# Altium schematic sheet Driver_BLDC.SchDoc
size 1600 x 1200 mm; SheetNumber: 1; SheetTotal: 1; SPICEModelCacheBTRAQOWF: <root> / <DocumentId>BTRAQOWF</DocumentId> / <CacheFrame Number="0"> / <Model Name="7850_74477530_1m" Kind="CKT"> / <Text>******* / .subckt 7850_74477530_1m 1 2 / Rp 1 2 187304.915771 / Cp 1 2 4.36976277949p / Rs 1 N3 3.3 / L1 N3 2 1000u / .ends 7850_74477530_1m</Text> / </Model> / </CacheFrame> / </root>
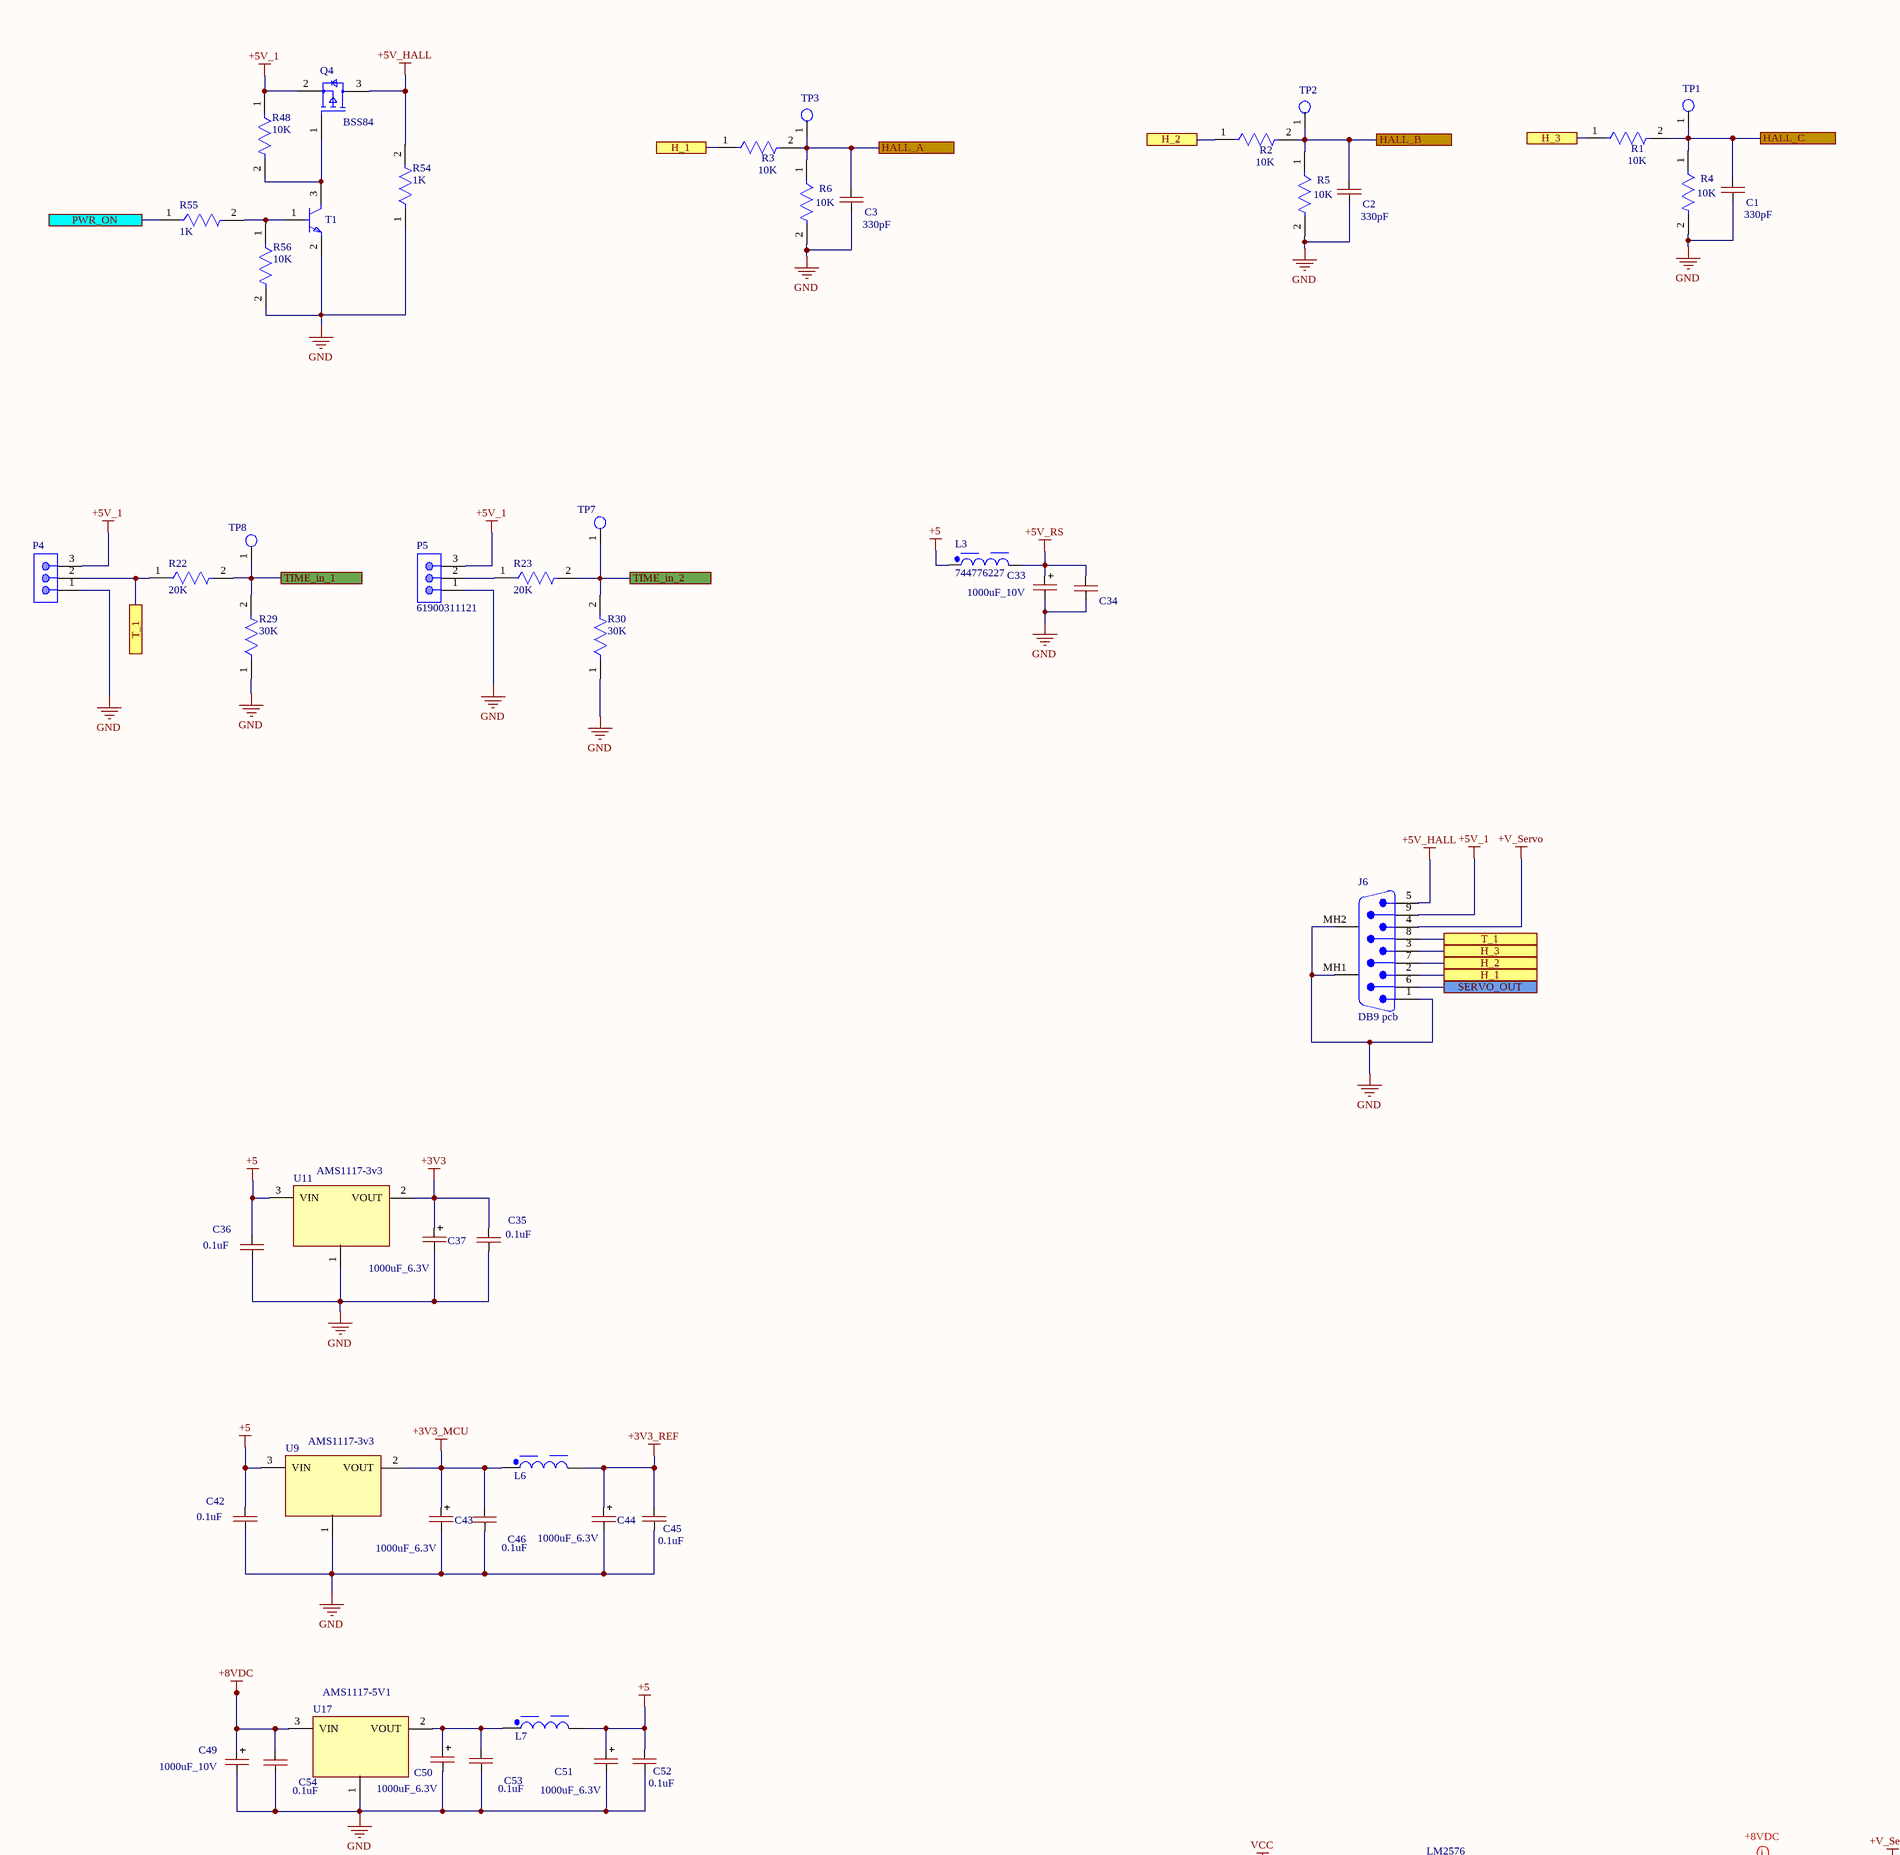
[diagram p0: Driver_BLDC.SchDoc, top column 1 of 4]
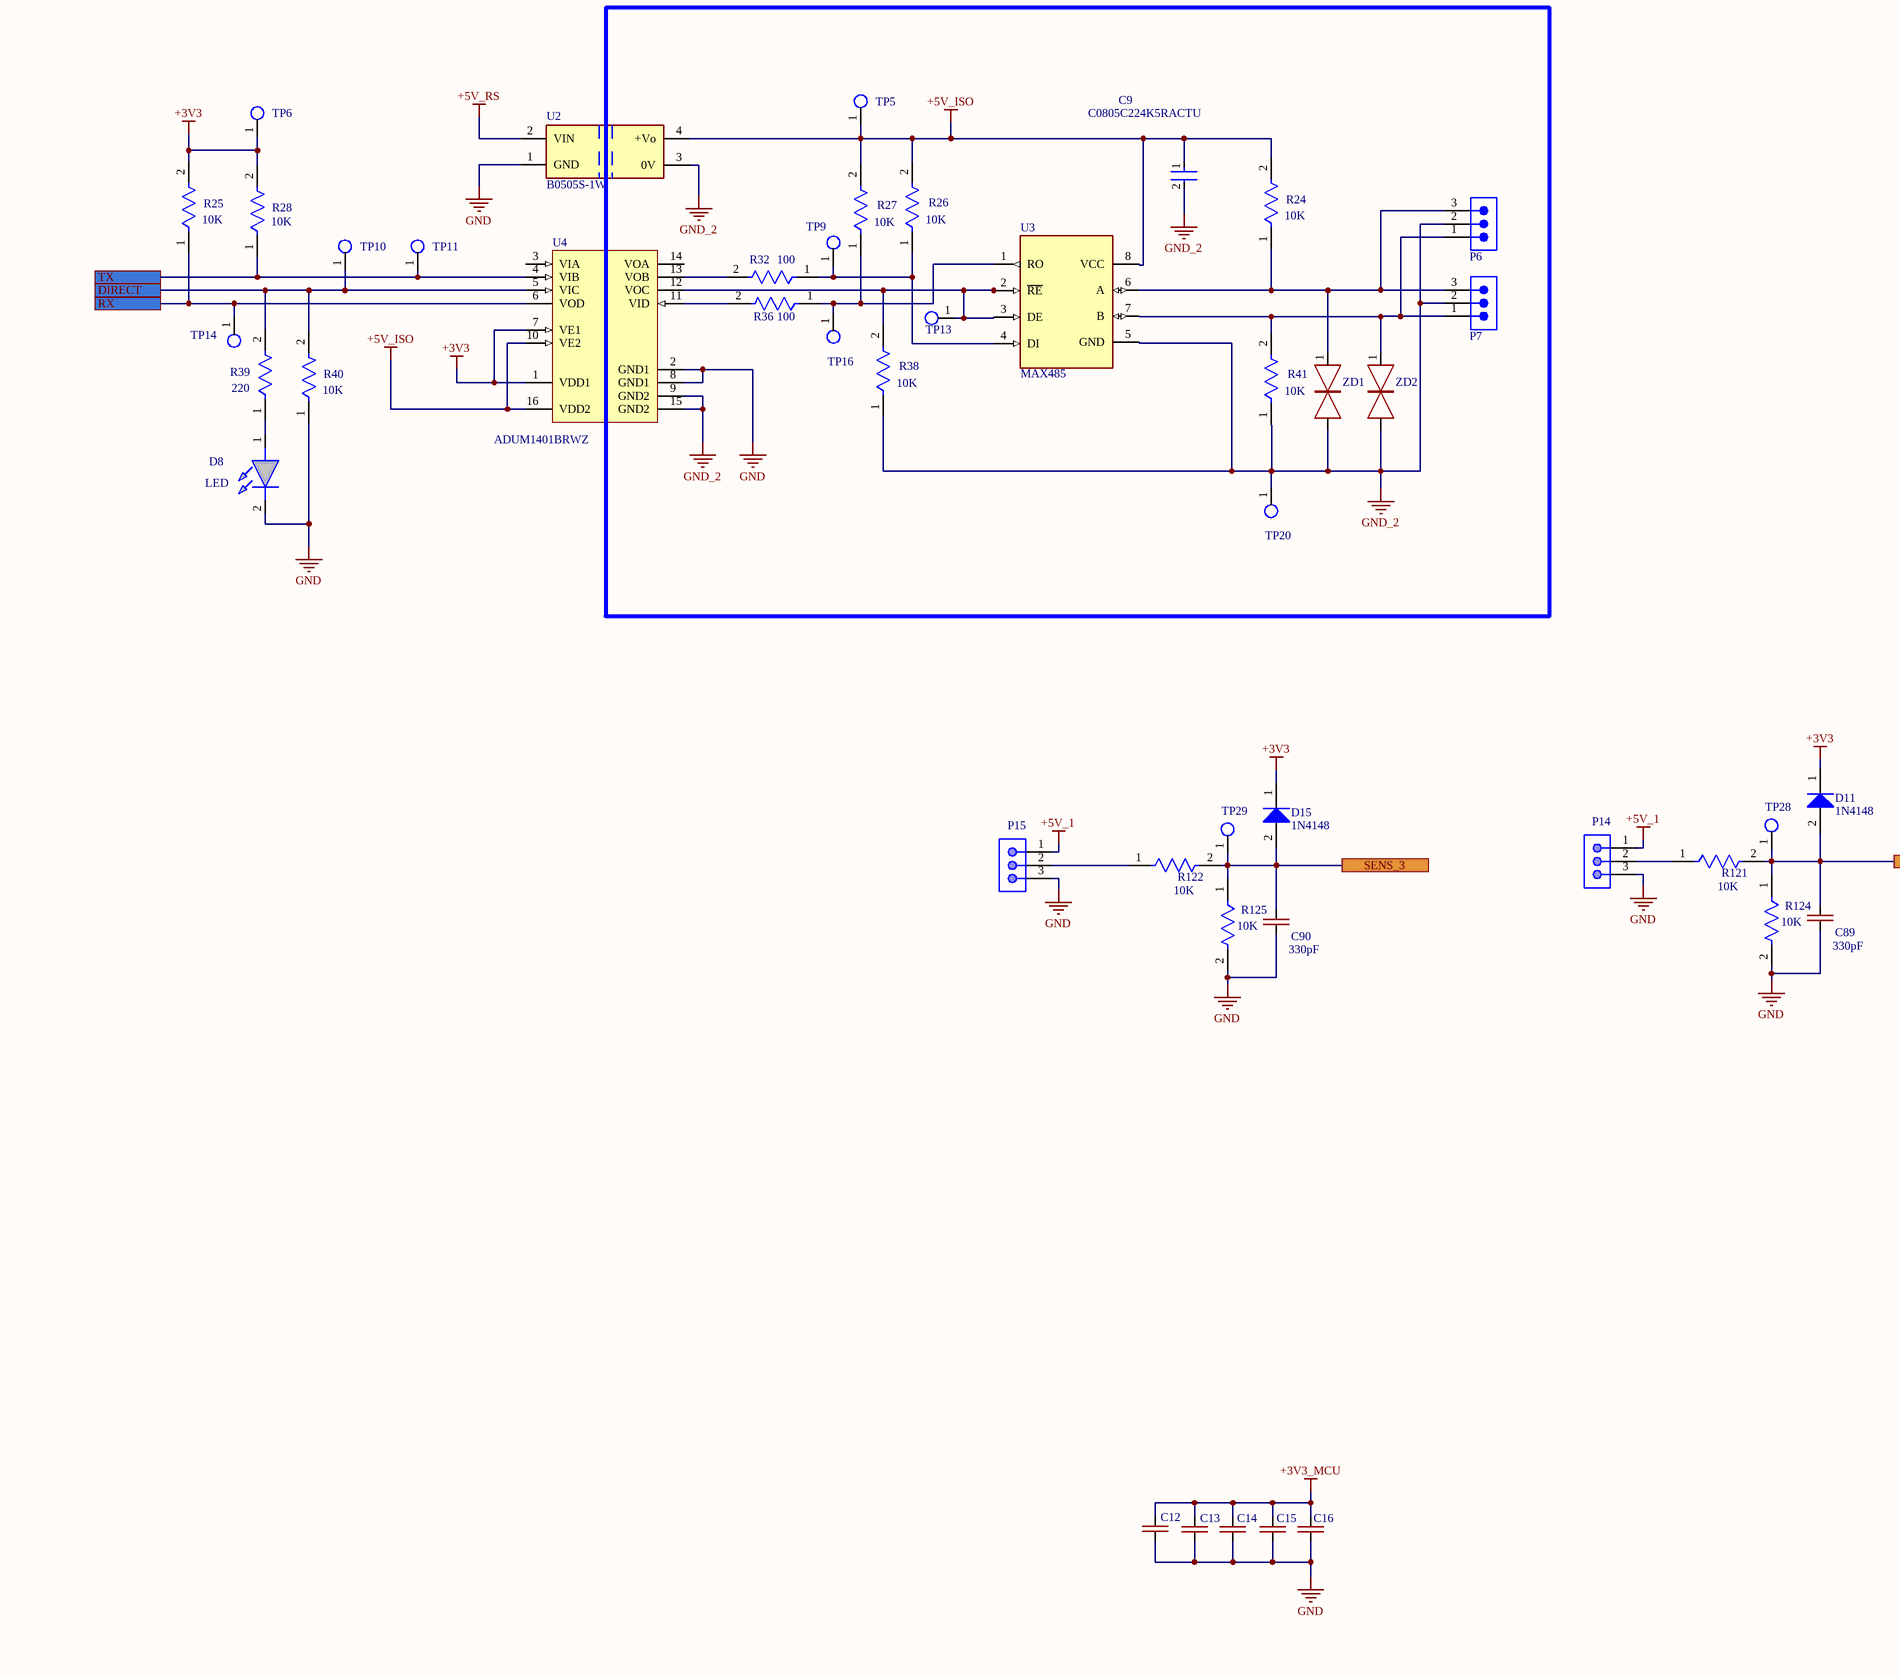
[diagram p1: Driver_BLDC.SchDoc, top column 2 of 4]
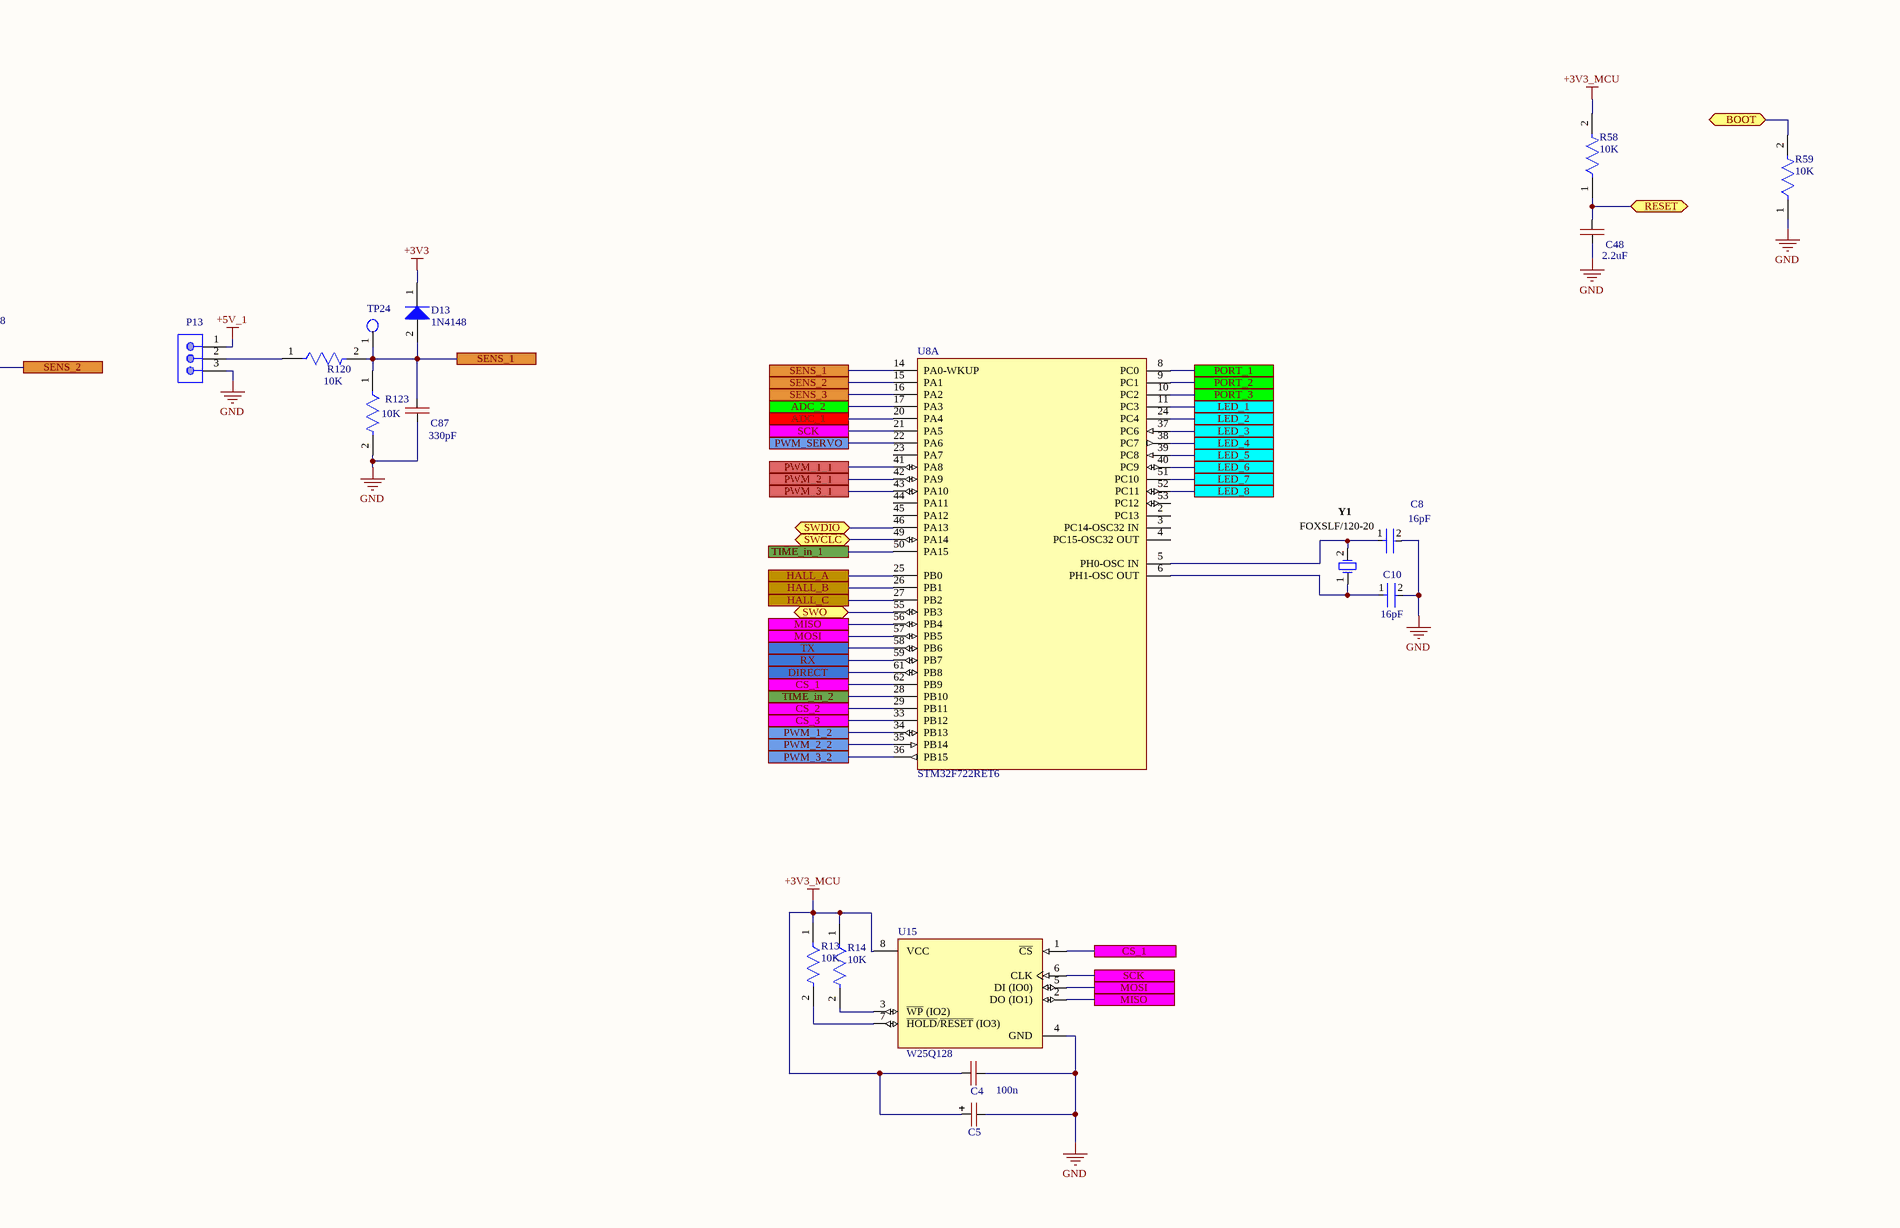
[diagram p2: Driver_BLDC.SchDoc, top column 3 of 4]
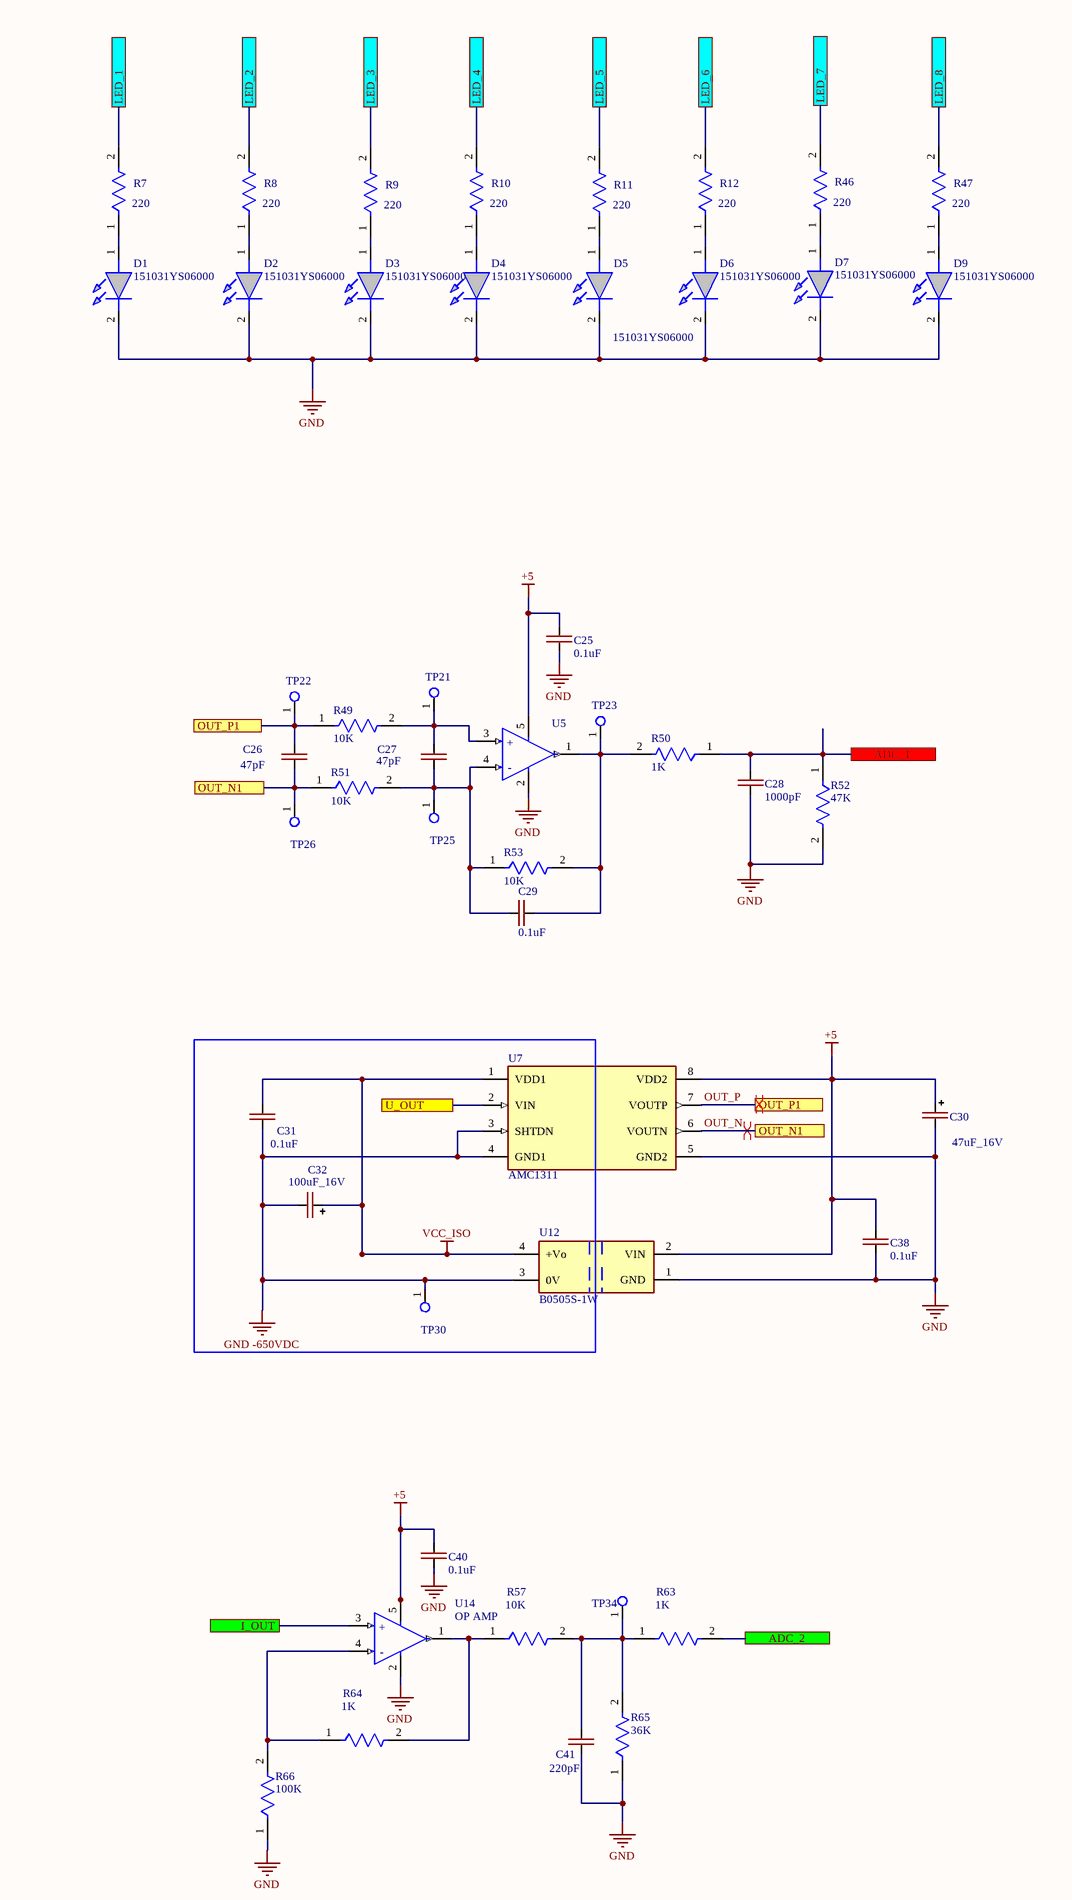
[diagram p3: Driver_BLDC.SchDoc, top column 4 of 4]
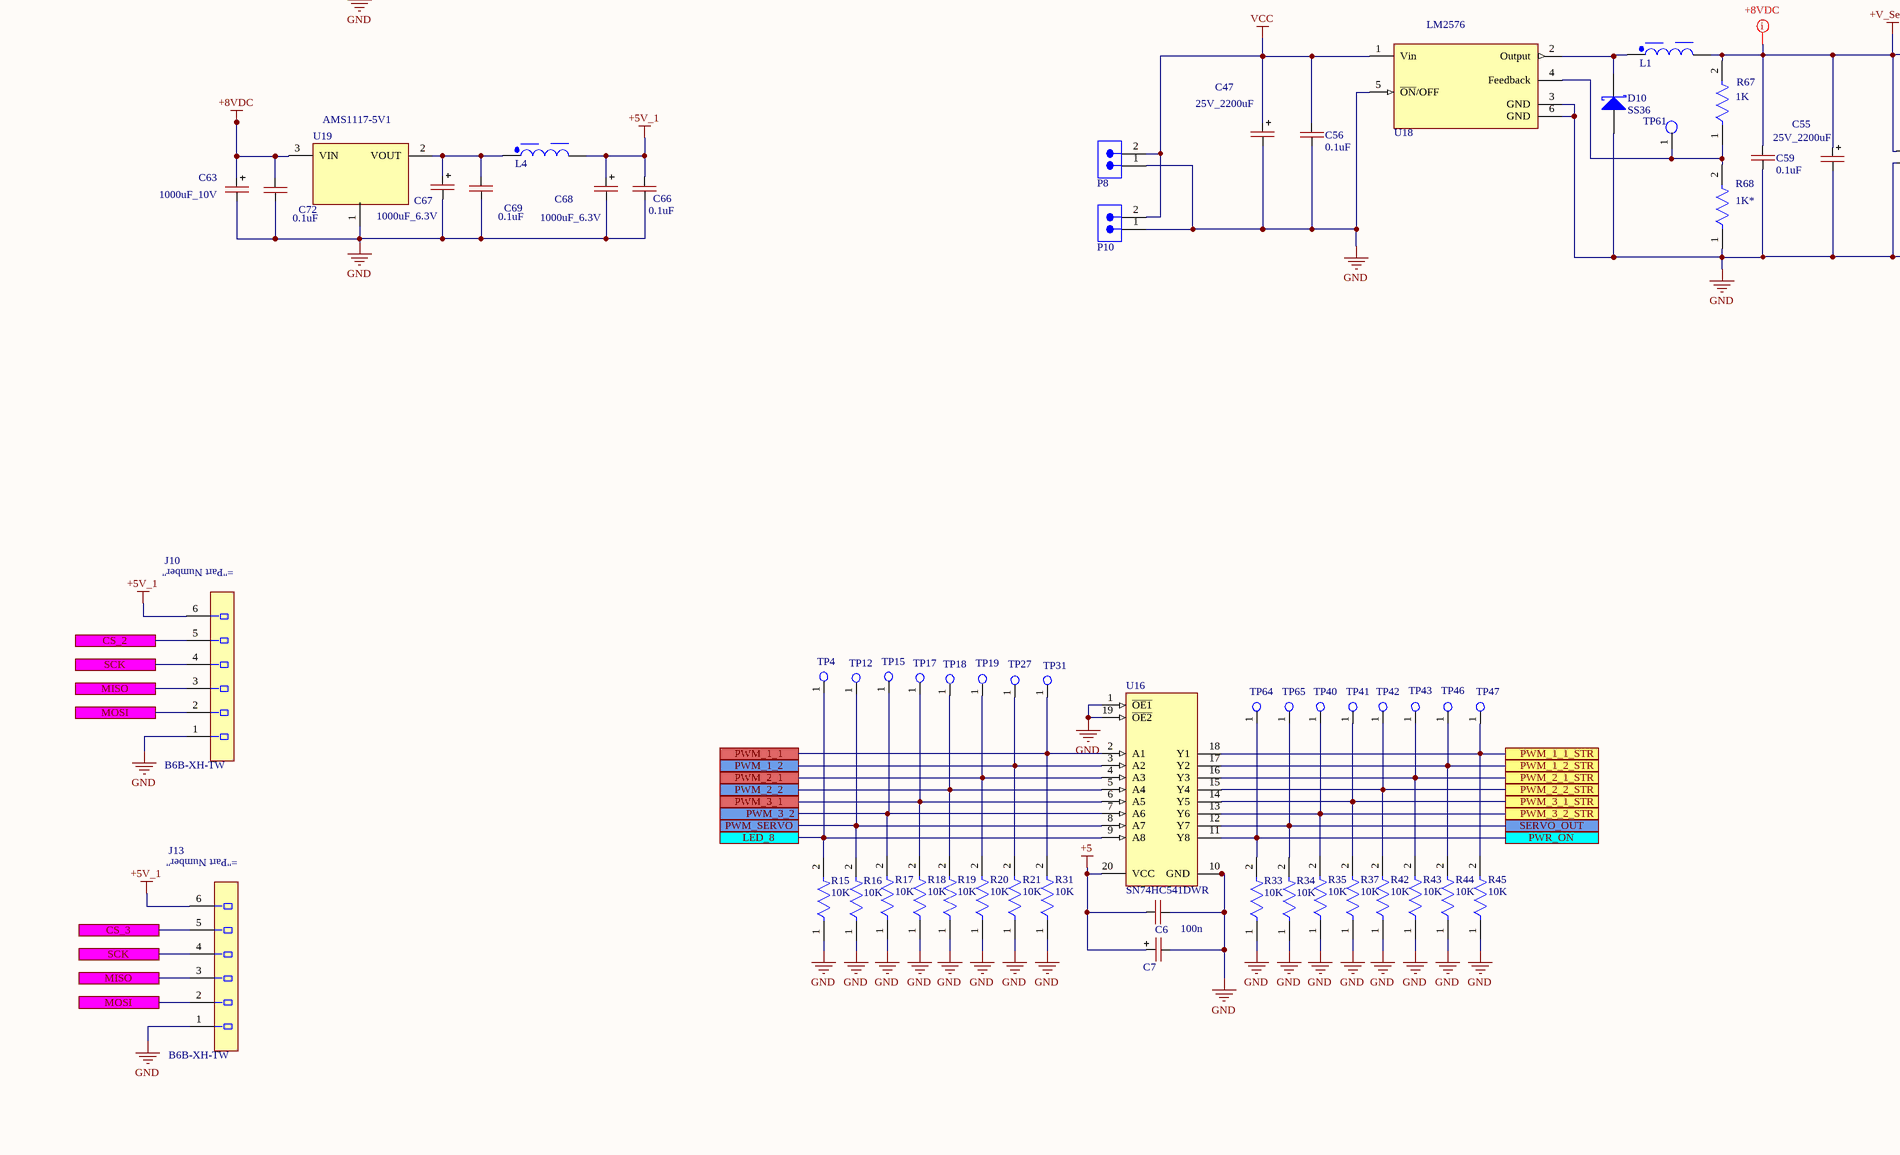
[diagram p4: Driver_BLDC.SchDoc, centre column 1 of 4]
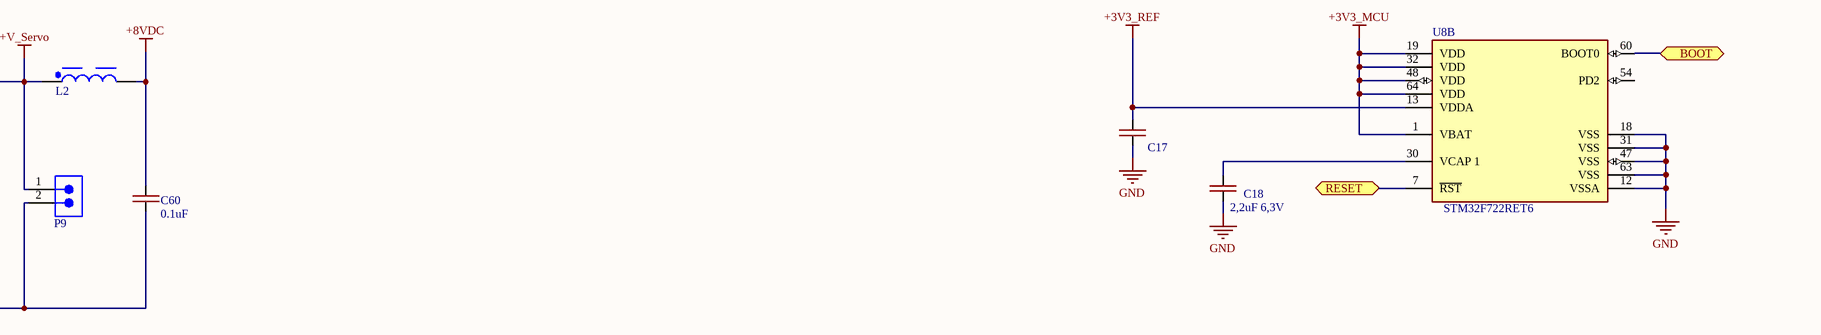
[diagram p5: Driver_BLDC.SchDoc, centre column 2 of 4]
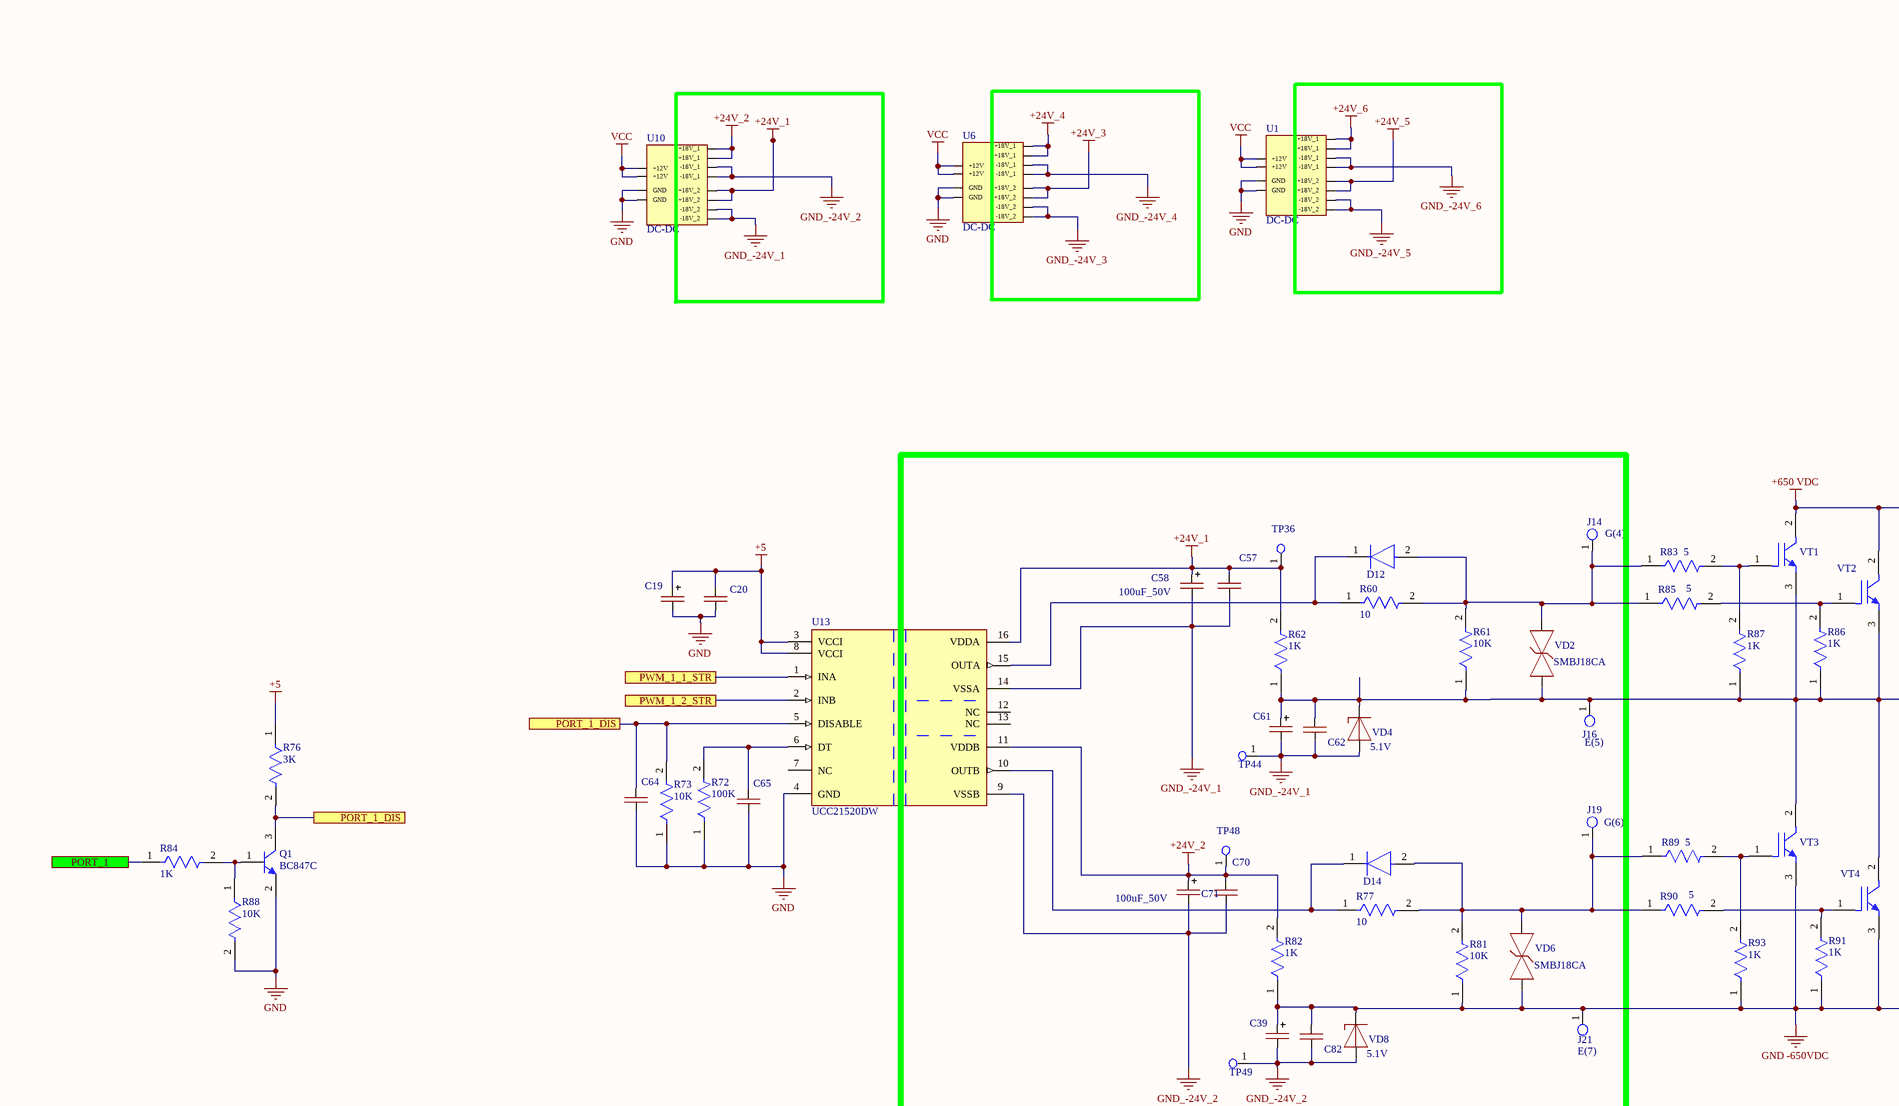
[diagram p6: Driver_BLDC.SchDoc, centre column 3 of 4]
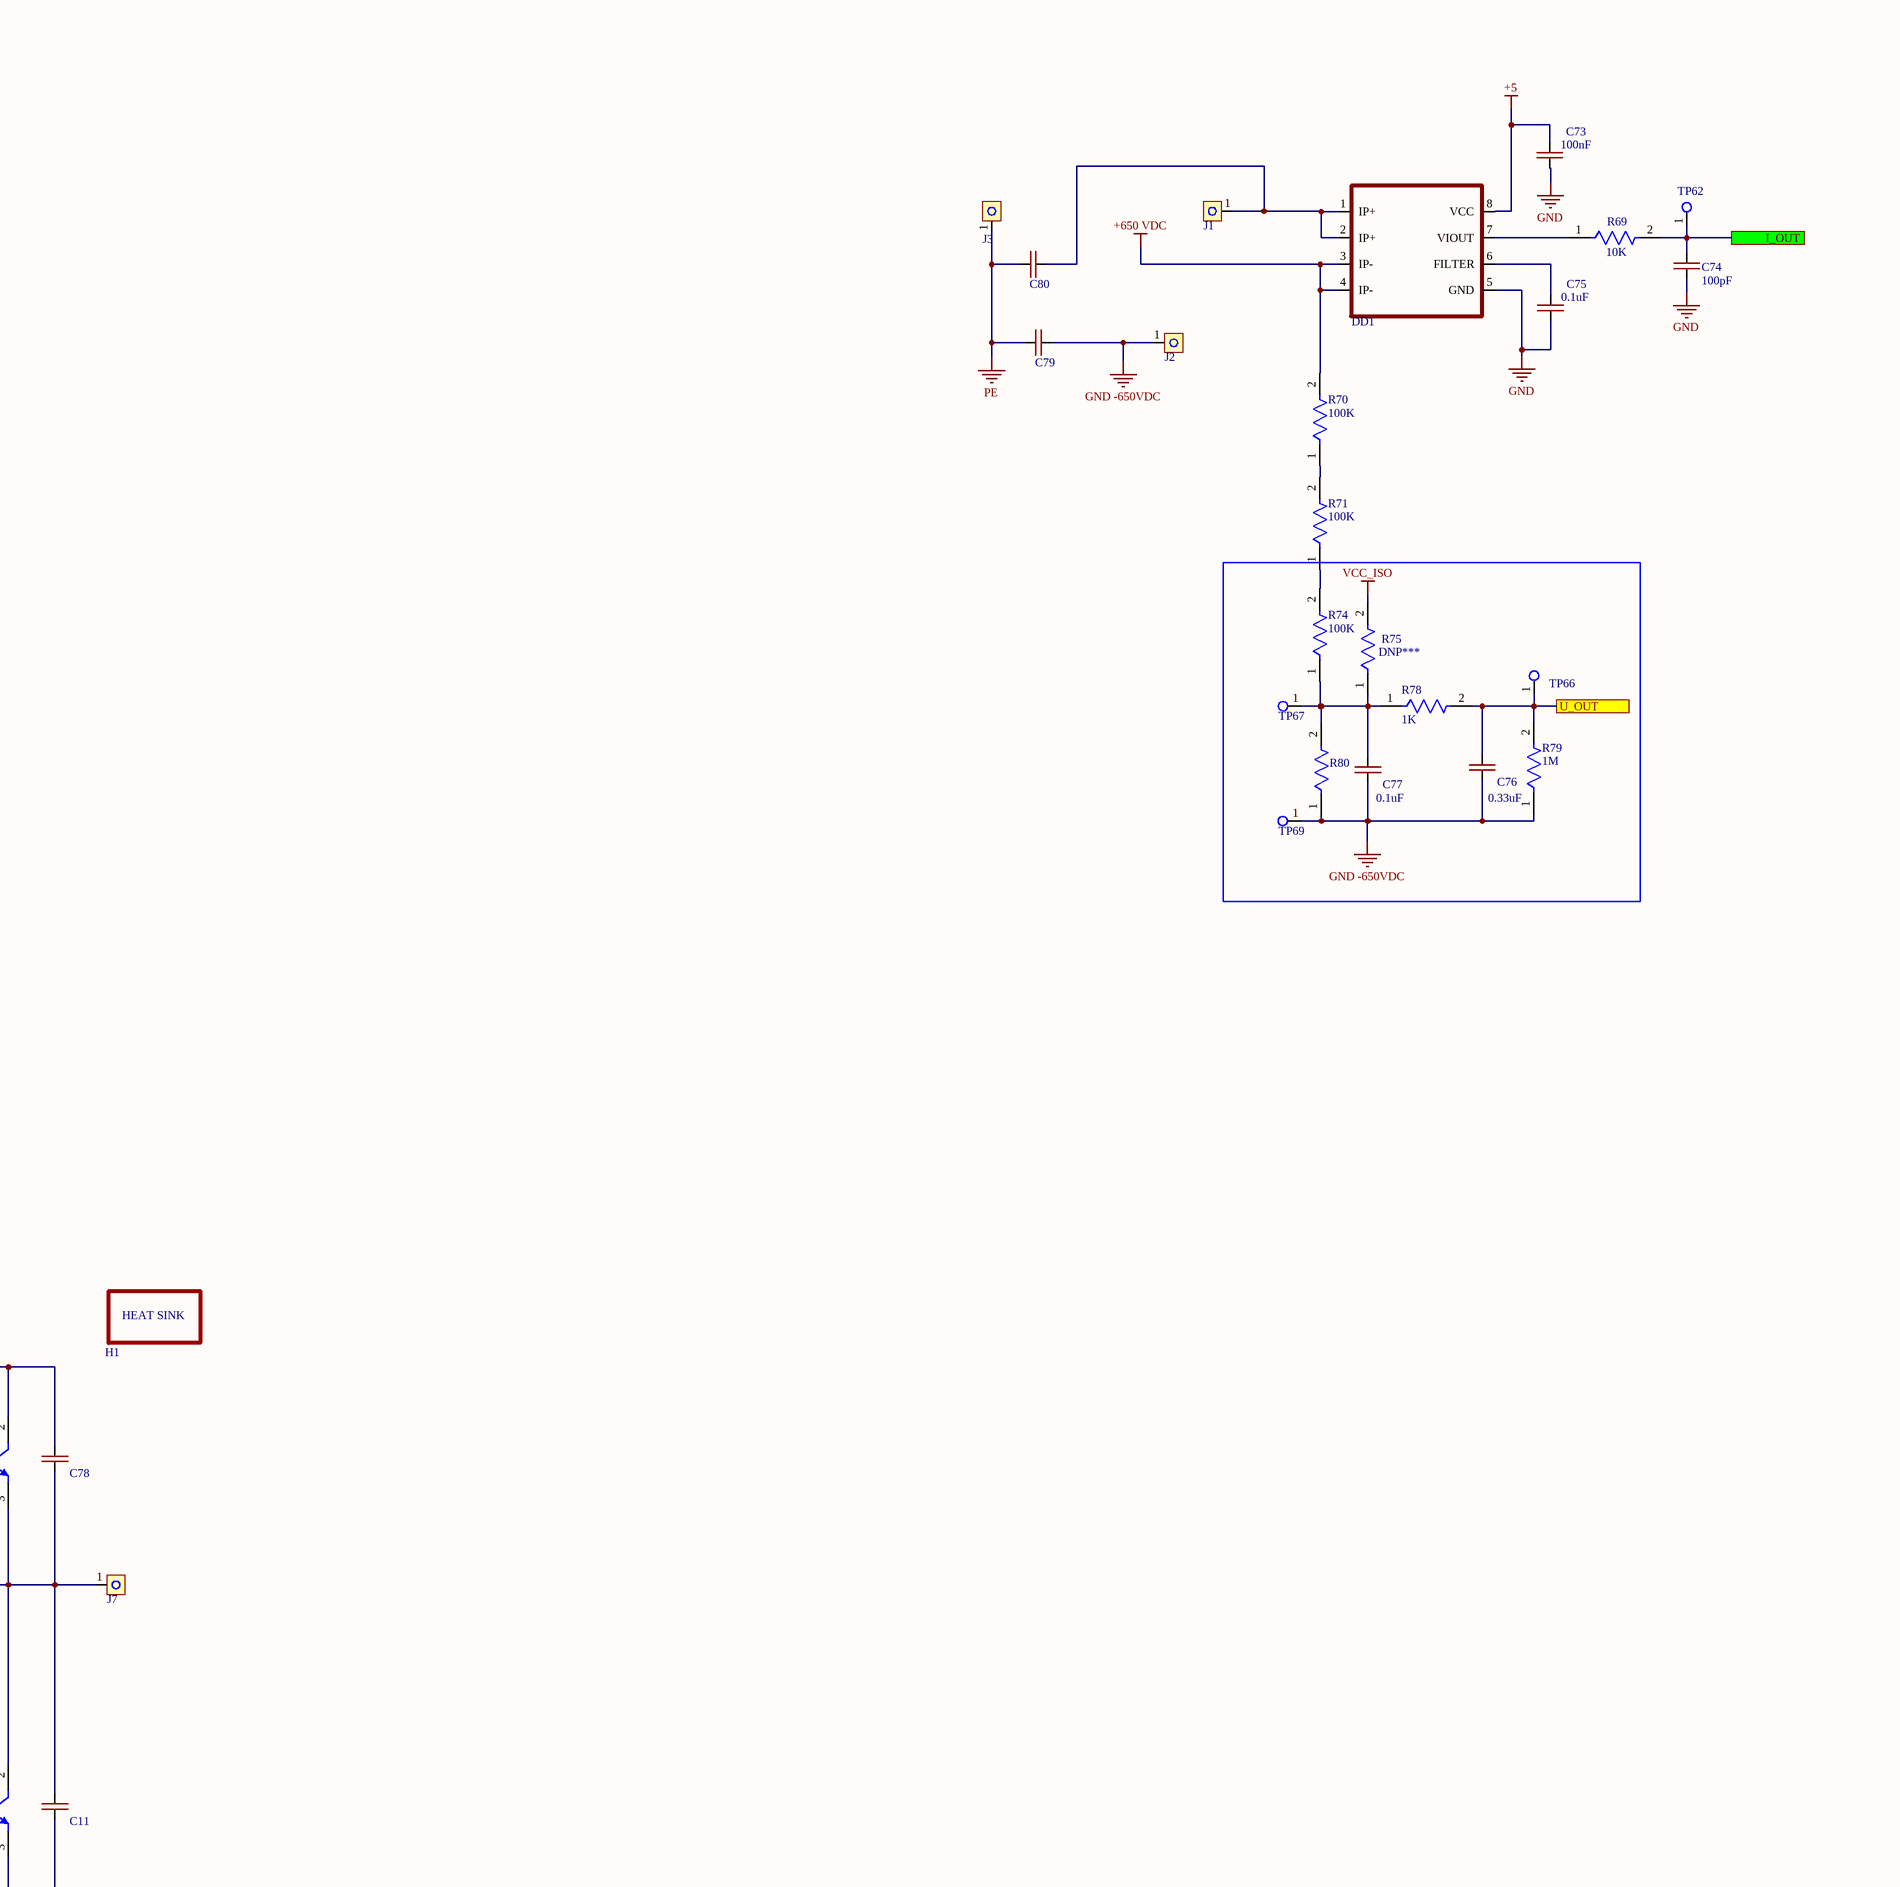
[diagram p7: Driver_BLDC.SchDoc, centre column 4 of 4]
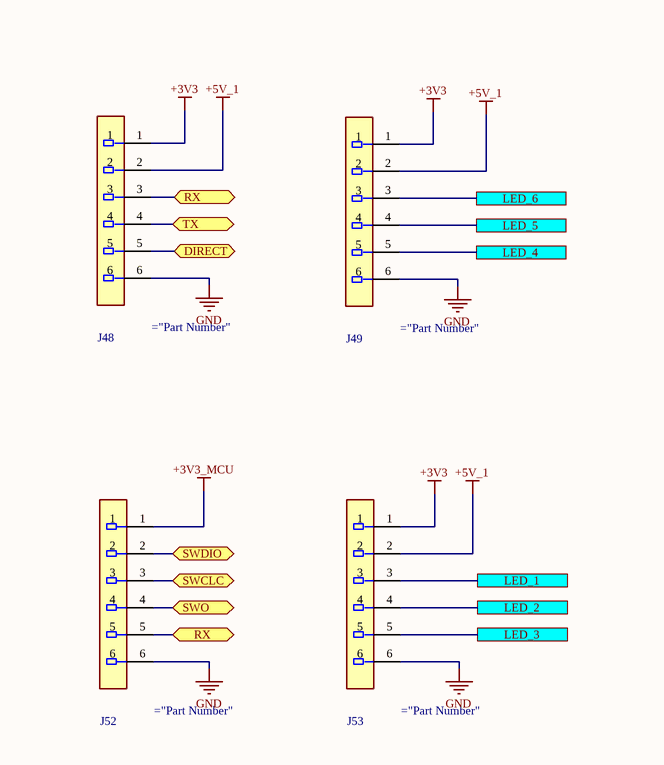
[diagram p8: Driver_BLDC.SchDoc, bottom column 1 of 4]
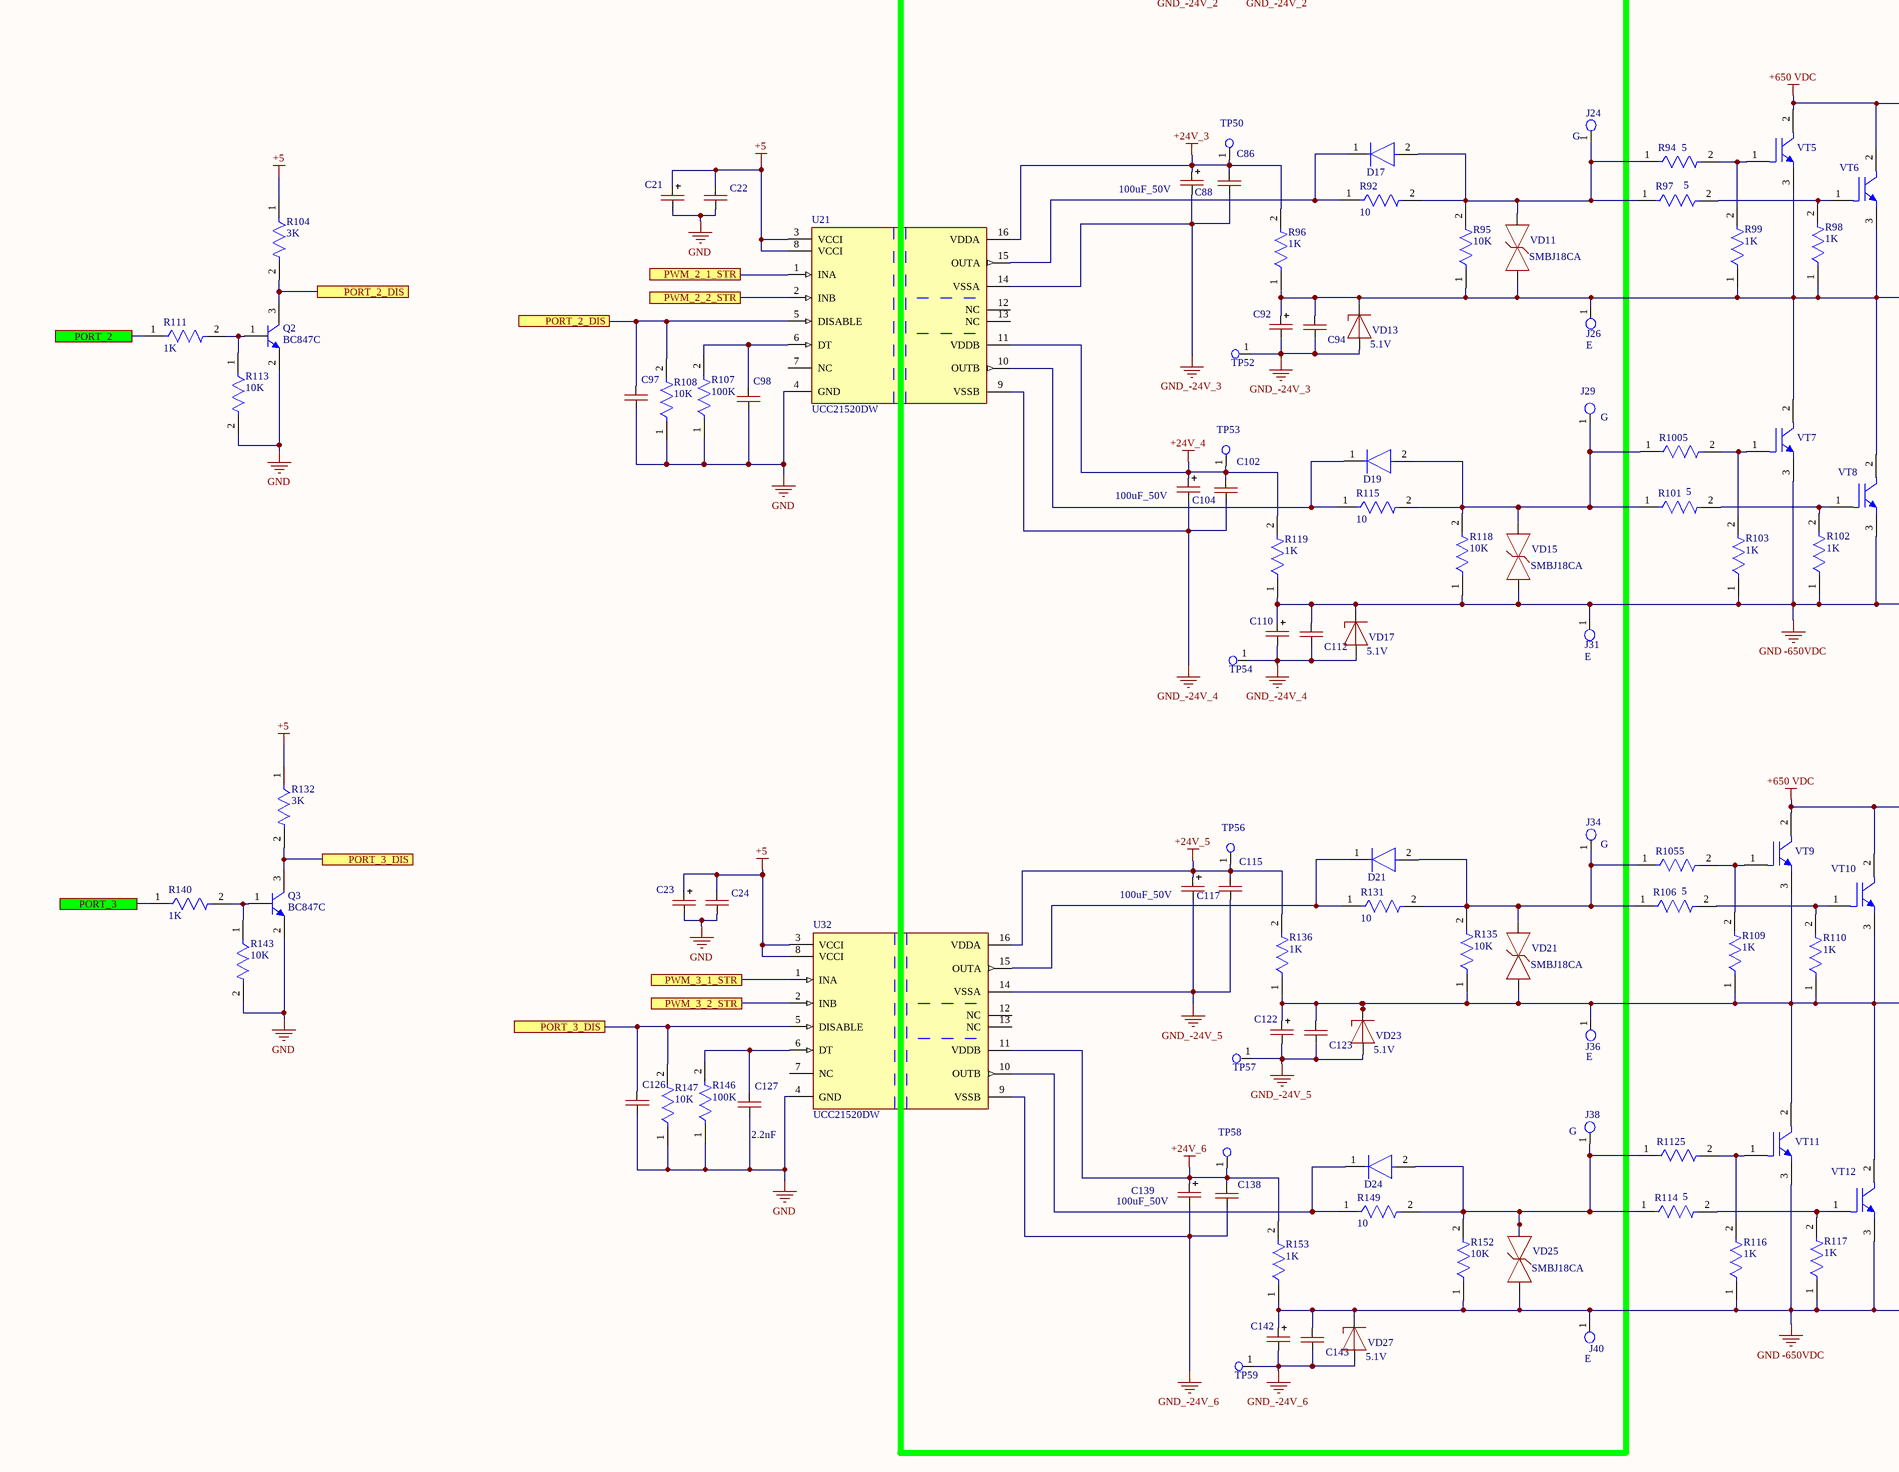
[diagram p9: Driver_BLDC.SchDoc, bottom column 3 of 4]
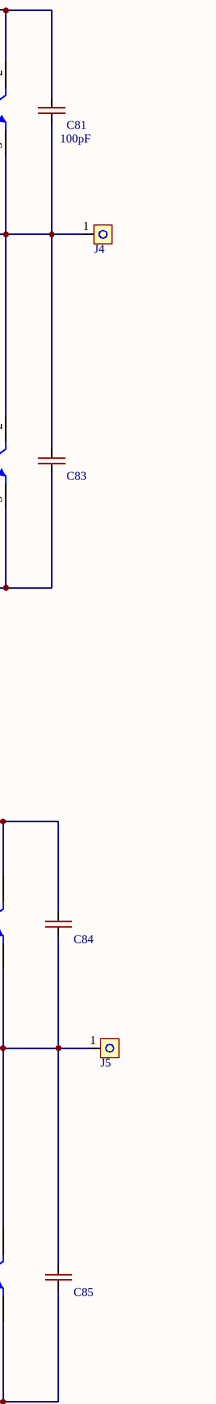
[diagram p10: Driver_BLDC.SchDoc, bottom column 4 of 4]

## Parts
C1  330pF  [CAP-0805]
C2  330pF  [CAP-0805]
C3  330pF  [CAP-0805]
C4  100n  [CAP-0805]
C5  CAP-POLAR  [CAP-TAN-D]  (value not drawn)
C6  100n  [CAP-0805]
C7  CAP-POLAR  [CAP-TAN-D]  (value not drawn)
C8  16pF  [FP-GRM21B-0_1-IPC_C]
C9  C0805C224K5RACTU  [FP-C0805C-DN-MFG]
C10  16pF  [FP-GRM21B-0_1-IPC_C]
C11  CAP-V  [CAP-V]  (value not drawn)
C12  CAP-NON-POLAR  [CAP-0805]  (value not drawn)
C13  CAP-NON-POLAR  [CAP-0805]  (value not drawn)
C14  CAP-NON-POLAR  [CAP-0805]  (value not drawn)
C15  CAP-NON-POLAR  [CAP-0805]  (value not drawn)
C16  CAP-NON-POLAR  [CAP-0805]  (value not drawn)
C17  CAP-NON-POLAR  [CAP-0805]  (value not drawn)
C18  2,2uF 6,3V  [CAP-0805]
C19  CAP-POLAR  [CAP-TAN-D]  (value not drawn)
C20  CAP-NON-POLAR  [CAP-0805]  (value not drawn)
C21  CAP-POLAR  [CAP-TAN-D]  (value not drawn)
C22  CAP-NON-POLAR  [CAP-0805]  (value not drawn)
C23  CAP-POLAR  [CAP-TAN-D]  (value not drawn)
C24  CAP-NON-POLAR  [CAP-0805]  (value not drawn)
C25  0.1uF  [CAP-0805]
C26  47pF  [CAP-0805]
C27  47pF  [CAP-0805]
C28  1000pF  [CAP-0805]
C29  0.1uF  [CAP-0805]
C30  47uF_16V  [CAP-TAN-D]
C31  0.1uF  [CAP-0805]
C32  100uF_16V  [CAP-TAN-D]
C33  1000uF_10V  [CAP_SMD_Size_G]
C34  CAP-NON-POLAR  [CAP-0805]  (value not drawn)
C35  0.1uF  [CAP-0805]
C36  0.1uF  [CAP-0805]
C37  1000uF_6.3V  [CAP_SMD_Size_E]
C38  0.1uF  [CAP-0805]
C39  CAP-POLAR  [CAP-TAN-D]  (value not drawn)
C40  0.1uF  [CAP-0805]
C41  220pF  [CAP-0805]
C42  0.1uF  [CAP-0805]
C43  1000uF_6.3V  [CAP_SMD_Size_E]
C44  1000uF_6.3V  [CAP_SMD_Size_E]
C45  0.1uF  [CAP-0805]
C46  0.1uF  [CAP-0805]
C47  25V_2200uF  [HITANO 3300uF 25V  16x25]
C48  2.2uF  [CAP-0805]
C49  1000uF_10V  [CAP_SMD_Size_G]
C50  1000uF_6.3V  [CAP_SMD_Size_E]
C51  1000uF_6.3V  [CAP_SMD_Size_E]
C52  0.1uF  [CAP-0805]
C53  0.1uF  [CAP-0805]
C54  0.1uF  [CAP-0805]
C55  25V_2200uF  [HITANO 3300uF 25V  16x25]
C56  0.1uF  [CAP-0805]
C57  CAP-NON-POLAR  [CAP-0805]  (value not drawn)
C58  100uF_50V  [CAP_SMD_Size_E]
C59  0.1uF  [CAP-0805]
C60  0.1uF  [CAP-0805]
C61  CAP-POLAR  [CAP-TAN-D]  (value not drawn)
C62  CAP-NON-POLAR  [CAP-0805]  (value not drawn)
C63  1000uF_10V  [CAP_SMD_Size_G]
C64  CAP-NON-POLAR  [CAP-0805]  (value not drawn)
C65  CAP-NON-POLAR  [CAP-0805]  (value not drawn)
C66  0.1uF  [CAP-0805]
C67  1000uF_6.3V  [CAP_SMD_Size_E]
C68  1000uF_6.3V  [CAP_SMD_Size_E]
C69  0.1uF  [CAP-0805]
C70  CAP-NON-POLAR  [CAP-0805]  (value not drawn)
C71  100uF_50V  [CAP_SMD_Size_E]
C72  0.1uF  [CAP-0805]
C73  100nF  [CAP-0805]
C74  100pF  [CAP-0805]
C75  0.1uF  [CAP-0805]
C76  0.33uF  [CAP-0805]
C77  0.1uF  [CAP-0805]
C78  CAP-V  [CAP-V]  (value not drawn)
C79  CAP-V  [CAP-V]  (value not drawn)
C80  CAP-V  [CAP-V]  (value not drawn)
C81  100pF  [CAP-V]
C82  CAP-NON-POLAR  [CAP-0805]  (value not drawn)
C83  CAP-V  [CAP-V]  (value not drawn)
C84  CAP-V  [CAP-V]  (value not drawn)
C85  CAP-V  [CAP-V]  (value not drawn)
C86  CAP-NON-POLAR  [CAP-0805]  (value not drawn)
C87  330pF  [CAP-0805]
C88  100uF_50V  [CAP_SMD_Size_E]
C89  330pF  [CAP-0805]
C90  330pF  [CAP-0805]
C92  CAP-POLAR  [CAP-TAN-D]  (value not drawn)
C94  CAP-NON-POLAR  [CAP-0805]  (value not drawn)
C97  CAP-NON-POLAR  [CAP-0805]  (value not drawn)
C98  CAP-NON-POLAR  [CAP-0805]  (value not drawn)
C102  CAP-NON-POLAR  [CAP-0805]  (value not drawn)
C104  100uF_50V  [CAP_SMD_Size_E]
C110  CAP-POLAR  [CAP-TAN-D]  (value not drawn)
C112  CAP-NON-POLAR  [CAP-0805]  (value not drawn)
C115  CAP-NON-POLAR  [CAP-0805]  (value not drawn)
C117  100uF_50V  [CAP_SMD_Size_E]
C122  CAP-POLAR  [CAP-TAN-D]  (value not drawn)
C123  CAP-NON-POLAR  [CAP-0805]  (value not drawn)
C126  CAP-NON-POLAR  [CAP-0805]  (value not drawn)
C127  2.2nF  [CAP-0805]
C138  CAP-NON-POLAR  [CAP-0805]  (value not drawn)
C139  100uF_50V  [CAP_SMD_Size_E]
C142  CAP-POLAR  [CAP-TAN-D]  (value not drawn)
C143  CAP-NON-POLAR  [CAP-0805]  (value not drawn)
D1  151031YS06000  [LED_RED]
D2  151031YS06000  [LED_GREEN]
D3  151031YS06000  [LED_YELLOW]
D4  151031YS06000  [LED_BLUE]
D5  151031YS06000  [LED_GREEN]
D6  151031YS06000  [LED_RED]
D7  151031YS06000  [LED_RED]
D8  LED  [LED_BLUE]
D9  151031YS06000  [LED_RED]
D10  SS36  [SMC/DO214AB]
D11  1N4148  [DIOD-SOD123-2_V]
D12  US1G  [US1G_SMA]  (value not drawn)
D13  1N4148  [DIOD-SOD123-2_V]
D14  US1G  [US1G_SMA]  (value not drawn)
D15  1N4148  [DIOD-SOD123-2_V]
D17  US1G  [US1G_SMA]  (value not drawn)
D19  US1G  [US1G_SMA]  (value not drawn)
D21  US1G  [US1G_SMA]  (value not drawn)
D24  US1G  [US1G_SMA]  (value not drawn)
DD1  ACS712  [SO8-150]  (value not drawn)
H1  HEAT SINK  [HEAT SINK]  (value not drawn)
J1  MG_136_HT  [Conn_MEIGAN_MG136HT]  (value not drawn)
J2  MG_136_HT  [Conn_MEIGAN_MG136HT]  (value not drawn)
J3  MG_136_HT  [Conn_MEIGAN_MG136HT]  (value not drawn)
J4  MG_136_HT  [Conn_MEIGAN_MG136HT]  (value not drawn)
J5  MG_136_HT  [Conn_MEIGAN_MG136HT]  (value not drawn)
J6  DB9 pcb  [DB9 conn pcb]
J7  MG_136_HT  [Conn_MEIGAN_MG136HT]  (value not drawn)
J10  B6B-XH-TW  [B6B-XH-TW]
J13  B6B-XH-TW  [B6B-XH-TW]
J14  G(4)  [Klema_PCB_15A]
J16  E(5)  [Klema_PCB_15A]
J19  G(6)  [Klema_PCB_15A]
J21  E(7)  [Klema_PCB_15A]
J24  G  [Klema_PCB_15A]
J26  E  [Klema_PCB_15A]
J29  G  [Klema_PCB_15A]
J31  E  [Klema_PCB_15A]
J34  G  [Klema_PCB_15A]
J36  E  [Klema_PCB_15A]
J38  G  [Klema_PCB_15A]
J40  E  [Klema_PCB_15A]
J48  (no value)  [Sullins_SWR25X-NRTC-S06-ST-BA_MFG]
J49  (no value)  [Sullins_SWR25X-NRTC-S06-ST-BA_MFG]
J52  (no value)  [Sullins_SWR25X-NRTC-S06-ST-BA_MFG]
J53  (no value)  [Sullins_SWR25X-NRTC-S06-ST-BA_MFG]
L1  22µH, 2.04A  [WE-PD2_1054]  (value not drawn)
L2  22µH, 2.04A  [WE-PD2_1054]  (value not drawn)
L3  744776227  [WE-PD2_1054]
L4  1000µH, 0.3A  [WE-PD2_7850]  (value not drawn)
L6  1000µH, 0.3A  [WE-PD2_7850]  (value not drawn)
L7  1000µH, 0.3A  [WE-PD2_7850]  (value not drawn)
P4  61900311121  [61900311121]  (value not drawn)
P5  61900311121  [61900311121]
P6  691305540003  [691305540003]  (value not drawn)
P7  691305540003  [691305540003]  (value not drawn)
P8  691305540002  [691305540002]  (value not drawn)
P9  691305540002  [691305540002]  (value not drawn)
P10  691305540002  [691305540002]  (value not drawn)
P13  61900311121  [61900311121]  (value not drawn)
P14  61900311121  [61900311121]  (value not drawn)
P15  61900311121  [61900311121]  (value not drawn)
Q1  BC847C  [INF-SOT23_N]
Q2  BC847C  [INF-SOT23_N]
Q3  BC847C  [INF-SOT23_N]
Q4  BSS84  [FP-SOT23-IPC_A]
R1  10K  [RES-0805]
R2  10K  [RES-0805]
R3  10K  [RES-0805]
R4  10K  [RES-0805]
R5  10K  [RES-0805]
R6  10K  [RES-0805]
R7  220  [RES-0805]
R8  220  [RES-0805]
R9  220  [RES-0805]
R10  220  [RES-0805]
R11  220  [RES-0805]
R12  220  [RES-0805]
R13  10K  [RES-0805]
R14  10K  [RES-0805]
R15  10K  [RES-0805]
R16  10K  [RES-0805]
R17  10K  [RES-0805]
R18  10K  [RES-0805]
R19  10K  [RES-0805]
R20  10K  [RES-0805]
R21  10K  [RES-0805]
R22  20K  [RES-0805]
R23  20K  [RES-0805]
R24  10K  [RES-0805]
R25  10K  [RES-0805]
R26  10K  [RES-0805]
R27  10K  [RES-0805]
R28  10K  [RES-0805]
R29  30K  [RES-0805]
R30  30K  [RES-0805]
R31  10K  [RES-0805]
R32  100  [RES-0805]
R33  10K  [RES-0805]
R34  10K  [RES-0805]
R35  10K  [RES-0805]
R36  100  [RES-0805]
R37  10K  [RES-0805]
R38  10K  [RES-0805]
R39  220  [RES-0805]
R40  10K  [RES-0805]
R41  10K  [RES-0805]
R42  10K  [RES-0805]
R43  10K  [RES-0805]
R44  10K  [RES-0805]
R45  10K  [RES-0805]
R46  220  [RES-0805]
R47  220  [RES-0805]
R48  10K  [RES-0805]
R49  10K  [RES-0805]
R50  1K  [RES-0805]
R51  10K  [RES-0805]
R52  47K  [RES-0805]
R53  10K  [RES-0805]
R54  1K  [RES-0805]
R55  1K  [RES-0805]
R56  10K  [RES-0805]
R57  10K  [RES-0805]
R58  10K  [RES-0805]
R59  10K  [RES-0805]
R60  10  [RES-2512]
R61  10K  [RES-0805]
R62  1K  [RES-2512]
R63  1K  [RES-0805]
R64  1K  [RES-0805]
R65  36K  [RES-0805]
R66  100K  [RES-0805]
R67  1K  [RES-0805]
R68  1K*  [RES-0805]
R69  10K  [RES-0805]
R70  100K  [RES-2512]
R71  100K  [RES-2512]
R72  100K  [RES-0805]
R73  10K  [RES-0805]
R74  100K  [RES-2512]
R75  DNP***  [RES-0805]
R76  3K  [RES-0805]
R77  10  [RES-2512]
R78  1K  [RES-0805]
R79  1M  [RES-0805]
R80  RES_1210  [RES_SMD_1210_IPC_B]  (value not drawn)
R81  10K  [RES-0805]
R82  1K  [RES-2512]
R83  5  [RES-0805]
R84  1K  [RES-0805]
R85  5  [RES-0805]
R86  1K  [RES-0805]
R87  1K  [RES-0805]
R88  10K  [RES-0805]
R89  5  [RES-0805]
R90  5  [RES-0805]
R91  1K  [RES-0805]
R92  10  [RES-2512]
R93  1K  [RES-0805]
R94  5  [RES-0805]
R95  10K  [RES-0805]
R96  1K  [RES-2512]
R97  5  [RES-0805]
R98  1K  [RES-0805]
R99  1K  [RES-0805]
R100  5  [RES-0805]
R101  5  [RES-0805]
R102  1K  [RES-0805]
R103  1K  [RES-0805]
R104  3K  [RES-0805]
R105  5  [RES-0805]
R106  5  [RES-0805]
R107  100K  [RES-0805]
R108  10K  [RES-0805]
R109  1K  [RES-0805]
R110  1K  [RES-0805]
R111  1K  [RES-0805]
R112  5  [RES-0805]
R113  10K  [RES-0805]
R114  5  [RES-0805]
R115  10  [RES-2512]
R116  1K  [RES-0805]
R117  1K  [RES-0805]
R118  10K  [RES-0805]
R119  1K  [RES-2512]
R120  10K  [RES-0805]
R121  10K  [RES-0805]
R122  10K  [RES-0805]
R123  10K  [RES-0805]
R124  10K  [RES-0805]
R125  10K  [RES-0805]
R131  10  [RES-2512]
R132  3K  [RES-0805]
R135  10K  [RES-0805]
R136  1K  [RES-2512]
R140  1K  [RES-0805]
R143  10K  [RES-0805]
R146  100K  [RES-0805]
R147  10K  [RES-0805]
R149  10  [RES-2512]
R152  10K  [RES-0805]
R153  1K  [RES-2512]
T1  BC847C  [SOT23-3_IPC_A]  (value not drawn)
TP1  (no value)  [Test_Point]
TP2  (no value)  [Test_Point]
TP3  (no value)  [Test_Point]
TP4  Test_Point_PCB  [Test_Point]  (value not drawn)
TP5  Test_Point_PCB  [Test_Point]  (value not drawn)
TP6  (no value)  [Test_Point]
TP7  (no value)  [Test_Point]
TP8  (no value)  [Test_Point]
TP9  Test_Point_PCB  [Test_Point]  (value not drawn)
TP10  Test_Point_PCB  [Test_Point]  (value not drawn)
TP11  Test_Point_PCB  [Test_Point]  (value not drawn)
TP12  Test_Point_PCB  [Test_Point]  (value not drawn)
TP13  Test_Point_PCB  [Test_Point]  (value not drawn)
TP14  Test_Point_PCB  [Test_Point]  (value not drawn)
TP15  Test_Point_PCB  [Test_Point]  (value not drawn)
TP16  (no value)  [Test_Point]
TP17  Test_Point_PCB  [Test_Point]  (value not drawn)
TP18  Test_Point_PCB  [Test_Point]  (value not drawn)
TP19  Test_Point_PCB  [Test_Point]  (value not drawn)
TP20  Test_Point_PCB  [Test_Point]  (value not drawn)
TP21  Test_Point_PCB  [Test_Point]  (value not drawn)
TP22  Test_Point_PCB  [Test_Point]  (value not drawn)
TP23  Test_Point_PCB  [Test_Point]  (value not drawn)
TP24  (no value)  [Test_Point]
TP25  Test_Point_PCB  [Test_Point]  (value not drawn)
TP26  Test_Point_PCB  [Test_Point]  (value not drawn)
TP27  Test_Point_PCB  [Test_Point]  (value not drawn)
TP28  (no value)  [Test_Point]
TP29  (no value)  [Test_Point]
TP30  Test_Point_PCB  [Pin_Test_Point(Pink)]  (value not drawn)
TP31  Test_Point_PCB  [Test_Point]  (value not drawn)
TP34  Test_Point_PCB  [Test_Point]  (value not drawn)
TP36  Test_Point_PCB  [Test_Point]  (value not drawn)
TP40  Test_Point_PCB  [Test_Point]  (value not drawn)
TP41  Test_Point_PCB  [Test_Point]  (value not drawn)
TP42  Test_Point_PCB  [Test_Point]  (value not drawn)
TP43  Test_Point_PCB  [Test_Point]  (value not drawn)
TP44  Test_Point_PCB  [Test_Point]  (value not drawn)
TP46  Test_Point_PCB  [Test_Point]  (value not drawn)
TP47  Test_Point_PCB  [Test_Point]  (value not drawn)
TP48  Test_Point_PCB  [Test_Point]  (value not drawn)
TP49  Test_Point_PCB  [Test_Point]  (value not drawn)
TP50  Test_Point_PCB  [Test_Point]  (value not drawn)
TP52  Test_Point_PCB  [Test_Point]  (value not drawn)
TP53  Test_Point_PCB  [Test_Point]  (value not drawn)
TP54  Test_Point_PCB  [Test_Point]  (value not drawn)
TP56  Test_Point_PCB  [Test_Point]  (value not drawn)
TP57  Test_Point_PCB  [Test_Point]  (value not drawn)
TP58  Test_Point_PCB  [Test_Point]  (value not drawn)
TP59  Test_Point_PCB  [Test_Point]  (value not drawn)
TP61  (no value)  [Test_Point]
TP62  Test_Point_PCB  [Test_Point]  (value not drawn)
TP64  Test_Point_PCB  [Test_Point]  (value not drawn)
TP65  Test_Point_PCB  [Test_Point]  (value not drawn)
TP66  Test_Point_PCB  [Test_Point]  (value not drawn)
TP67  Test_Point_PCB  [Test_Point]  (value not drawn)
TP69  Test_Point_PCB  [Test_Point]  (value not drawn)
U1  DC-DC  [DC-DC_Bridge]
U2  B0505S-1W  [B0505S-1W]
U3  MAX485  [SOIC-8-MFG]
U4  ADUM1401BRWZ  [ADI-RW-16_M]
U5  (no value)  [SOT-23-5]
U6  DC-DC  [DC-DC_Bridge]
U7  AMC1311  [FP-DWV0008A-MFG]
U8  STM32F722RET6  [LQFP64-5W-IPC_A]  (parts A,B of 2)
U9  AMS1117-3v3  [SOT-223-3]
U10  DC-DC  [DC-DC_Bridge]
U11  AMS1117-3v3  [SOT-223-3]
U12  B0505S-1W  [B0505S-1W]
U13  UCC21520DW  [FP-DW0016B-MFG]
U14  OP AMP  [SOT-23-5]
U15  W25Q128  [WINB-SOIC-8_M]
U16  SN74HC541DWR  [DW0020A_L]
U17  AMS1117-5V1  [SOT-223]
U18  LM2576  [ON_Semiconductor_936A-02_MFG]
U19  AMS1117-5V1  [SOT-223]
U21  UCC21520DW  [FP-DW0016B-MFG]
U32  UCC21520DW  [FP-DW0016B-MFG]
VD2  SMBJ18CA  [DO-214AA]
VD4  5.1V  [DO-35]
VD6  SMBJ18CA  [DO-214AA]
VD8  5.1V  [DO-35]
VD11  SMBJ18CA  [DO-214AA]
VD13  5.1V  [DO-35]
VD15  SMBJ18CA  [DO-214AA]
VD17  5.1V  [DO-35]
VD21  SMBJ18CA  [DO-214AA]
VD23  5.1V  [DO-35]
VD25  SMBJ18CA  [DO-214AA]
VD27  5.1V  [DO-35]
VT1  IGBT 60N120T  [TO-264-3]  (value not drawn)
VT2  IGBT 60N120T  [TO-264-3]  (value not drawn)
VT3  IGBT 60N120T  [TO-264-3]  (value not drawn)
VT4  IGBT 60N120T  [TO-264-3]  (value not drawn)
VT5  IGBT 60N120T  [TO-264-3]  (value not drawn)
VT6  IGBT 60N120T  [TO-264-3]  (value not drawn)
VT7  IGBT 60N120T  [TO-264-3]  (value not drawn)
VT8  IGBT 60N120T  [TO-264-3]  (value not drawn)
VT9  IGBT 60N120T  [TO-264-3]  (value not drawn)
VT10  IGBT 60N120T  [TO-264-3]  (value not drawn)
VT11  IGBT 60N120T  [TO-264-3]  (value not drawn)
VT12  IGBT 60N120T  [TO-264-3]  (value not drawn)
Y1  FOXSLF/120-20  [FOX-FOXSLF-2_V]
ZD1  P6SMB16CA  [DO-214AA]  (value not drawn)
ZD2  P6SMB16CA  [DO-214AA]  (value not drawn)

## Ports
ADC_1, ADC_2, BOOT (bidir), CS_1, CS_2, CS_3, DIRECT, DIRECT (bidir), H_1, H_2, H_3, HALL_A, HALL_B, HALL_C, I_OUT, LED_1, LED_2, LED_3, LED_4, LED_5, LED_6, LED_7, LED_8, MISO, MOSI, OUT_N1, OUT_P1, PORT_1, PORT_1_DIS, PORT_2, PORT_2_DIS, PORT_3, PORT_3_DIS, PWM_1_1, PWM_1_1_STR, PWM_1_2, PWM_1_2_STR, PWM_2_1, PWM_2_1_STR, PWM_2_2, PWM_2_2_STR, PWM_3_1, PWM_3_1_STR, PWM_3_2, PWM_3_2_STR, PWM_SERVO, PWR_ON, RESET (bidir), RX, RX (bidir), SCK, SENS_1, SENS_2, SENS_3, SERVO_OUT, SWCLC (bidir), SWDIO (bidir), SWO (bidir), T_1, TIME_in_1, TIME_in_2, TX, TX (bidir), U_OUT

## Nets
+3V3: C35.2 C37.1(+) D11.1(K) D13.1(K) D15.1(K) J48.1 J49.1 J53.1 R25.2 R28.2 TP6.1(G9) U4.1(VDD1) U4.7(VE1) U11.2(VOUT)
+3V3_MCU: C4.2 C5.1(+) C12.1 C13.1 C14.1 C15.1 C16.1 C43.1(+) C46.2 J52.1 L6.1 R13.1 R14.1 R58.2 U8.1(VBAT) U8.19(VDD) U8.32(VDD) U8.48(VDD) U8.64(VDD) U9.2(VOUT) U15.8(VCC)
+3V3_REF: C17.2 C44.1(+) C45.2 L6.2 U8.13(VDDA)
+5: C6.2 C7.1(+) C19.1(+) C20.2 C21.1(+) C22.2 C23.1(+) C24.2 C25.2 C30.1(+) C36.2 C38.1 C40.2 C42.2 C51.1(+) C52.2 C73.2 DD1.8(VCC) L3.1 L7.2 R76.1 R104.1 R132.1 U5.5(VDD) U7.8(VDD2) U9.3(VIN) U11.3(VIN) U12.2(VIN) U13.3(VCCI) U13.8(VCCI) U14.5(VDD) U16.20(VCC) U21.3(VCCI) U21.8(VCCI) U32.3(VCCI) U32.8(VCCI)
+5V_1: C66.2 C68.1(+) J6.9 J10.6 J13.6 J48.2 J49.2 J53.2 L4.2 P4.3 P5.3 P13.1 P14.1 P15.1 Q4.2(S) R48.1
+5V_HALL: J6.5 Q4.3(D) R54.2
+5V_ISO: C9.1 R24.2 R26.2 R27.2 TP5.1(G9) U2.4(+Vo) U3.8(VCC) U4.10(VE2) U4.16(VDD2)
+5V_RS: C33.1(+) C34.2 L3.2 U2.2(VIN)
+8VDC: C49.1(+) C54.2 C60.2 C63.1(+) C72.2 L2.2 U17.3(VIN) U19.3(VIN)
+24V_1: C57.2 C58.1(+) R62.2 TP36.1(G9) U10.17(+18V_2) U10.18(+18V_2) U13.16(VDDA)
+24V_2: C70.2 C71.1(+) R82.2 TP48.1(G9) U10.1(+18V_1) U10.2(+18V_1) U13.11(VDDB)
+24V_3: C86.2 C88.1(+) R96.2 TP50.1(G9) U6.17(+18V_2) U6.18(+18V_2) U21.16(VDDA)
+24V_4: C102.2 C104.1(+) R119.2 TP53.1(G9) U6.1(+18V_1) U6.2(+18V_1) U21.11(VDDB)
+24V_5: C115.2 C117.1(+) R136.2 TP56.1(G9) U1.17(+18V_2) U1.18(+18V_2) U32.16(VDDA)
+24V_6: C138.2 C139.1(+) R153.2 TP58.1(G9) U1.1(+18V_1) U1.2(+18V_1) U32.11(VDDB)
+650 VDC: C78.2 C81.2 C84.2 DD1.3(IP-) DD1.4(IP-) R70.2 VT1.2(C) VT2.2(C) VT5.2(C) VT6.2(C) VT9.2(C) VT10.2(C)
+V_Servo: C55.1(+) C59.2 J6.4 L1.2 L2.1 P9.1 R67.2
GND: C1.1 C2.1 C3.1 C4.1 C5.2(-) C6.1 C7.2(-) C8.2 C10.2 C12.2 C13.2 C14.2 C15.2 C16.2 C17.1 C18.1 C19.2(-) C20.1 C21.2(-) C22.1 C23.2(-) C24.1 C25.1 C28.1 C30.2(-) C33.2(-) C34.1 C35.1 C36.1 C37.2(-) C38.2 C40.1 C41.1 C42.1 C43.2(-) C44.2(-) C45.1 C46.1 C47.2(-) C48.1 C49.2(-) C50.2(-) C51.2(-) C52.1 C53.1 C54.1 C55.2(-) C56.1 C59.1 C60.1 C63.2(-) C64.1 C65.1 C66.1 C67.2(-) C68.2(-) C69.1 C72.1 C73.1 C74.1 C75.1 C87.1 C89.1 C90.1 C97.1 C98.1 C126.1 C127.1 D1.2(K) D2.2(K) D3.2(K) D4.2(K) D5.2(K) D6.2(K) D7.2(K) D8.2(K) D9.2(K) D10.2(A) DD1.5(GND) J6.1 J6.MH1 J6.MH2 J10.1 J13.1 J48.6 J49.6 J52.6 J53.6 P4.1 P5.1 P8.1 P9.2 P10.1 P13.3 P14.3 P15.3 Q1.2(E) Q2.2(E) Q3.2(E) R4.2 R5.2 R6.2 R15.1 R16.1 R17.1 R18.1 R19.1 R20.1 R21.1 R29.1 R30.1 R31.1 R33.1 R34.1 R35.1 R37.1 R40.1 R42.1 R43.1 R44.1 R45.1 R52.2 R54.1 R56.2 R59.1 R65.1 R66.1 R68.1 R72.1 R73.1 R88.2 R107.1 R108.1 R113.2 R123.2 R124.2 R125.2 R143.2 R146.1 R147.1 T1.2(E) U1.10(GND) U1.11(GND) U2.1(GND) U4.2(GND1) U4.8(GND1) U5.2(VSS) U6.10(GND) U6.11(GND) U7.5(GND2) U8.12(VSSA) U8.18(VSS) U8.31(VSS) U8.47(VSS) U8.63(VSS) U9.1(Ground) U10.10(GND) U10.11(GND) U11.1(Ground) U12.1(GND) U13.4(GND) U14.2(VSS) U15.4(GND) U16.1(~{OE1}) U16.10(GND) U16.19(~{OE2}) U17.1(Ground) U18.3(GND) U18.5(~{ON}/OFF) U18.6(GND) U19.1(Ground) U21.4(GND) U32.4(GND)
GND -650VDC: C11.1 C31.1 C32.2(-) C39.1(+) C76.1 C77.1 C79.1 C82.2 C83.1 C85.1 C110.1(+) C112.2 C142.1(+) C143.2 J2.1 J21.1 J31.1 J40.1 R79.1 R80.1 R81.1 R82.1 R91.1 R93.1 R102.1 R103.1 R116.1 R117.1 R118.1 R119.1 R152.1 R153.1 TP30.1(G9) TP69.1(G9) U7.3(SHTDN) U7.4(GND1) U12.3(0V) VD6.1(C) VD8.1(C) VD15.1(C) VD17.1(C) VD25.1(C) VD27.1(C) VT3.3(E) VT4.3(E) VT7.3(E) VT8.3(E) VT11.3(E) VT12.3(E)
GND_2: C9.2 P6.2 P7.2 R38.1 R41.1 TP20.1(G9) U2.3(0V) U3.5(GND) U4.9(GND2) U4.15(GND2) ZD1.2(A) ZD2.2(A)
GND_-24V_1: C57.1 C58.2(-) C61.2(-) C62.1 TP44.1(G9) U10.15(-18V_2) U10.16(-18V_2) U13.14(VSSA) VD4.2(A)
GND_-24V_2: C39.2(-) C70.1 C71.2(-) C82.1 TP49.1(G9) U10.3(-18V_1) U10.4(-18V_1) U13.9(VSSB) VD8.2(A)
GND_-24V_3: C86.1 C88.2(-) C92.2(-) C94.1 TP52.1(G9) U6.15(-18V_2) U6.16(-18V_2) U21.14(VSSA) VD13.2(A)
GND_-24V_4: C102.1 C104.2(-) C110.2(-) C112.1 TP54.1(G9) U6.3(-18V_1) U6.4(-18V_1) U21.9(VSSB) VD17.2(A)
GND_-24V_5: C115.1 C117.2(-) C122.2(-) C123.1 TP57.1(G9) U1.15(-18V_2) U1.16(-18V_2) U32.14(VSSA) VD23.2(A)
GND_-24V_6: C138.1 C139.2(-) C142.2(-) C143.1 TP59.1(G9) U1.3(-18V_1) U1.4(-18V_1) U32.9(VSSB) VD27.2(A)
PE: C79.2 C80.2 J3.1
VCC: C47.1(+) C56.2 P8.2 P10.2 U1.8(+12V) U1.9(+12V) U6.8(+12V) U6.9(+12V) U10.8(+12V) U10.9(+12V) U18.1(Vin)
VCC_ISO: C31.2 C32.1(+) R75.2 U7.1(VDD1) U12.4(+Vo)
ADC_1: C28.2 R50.1 R52.1 U8.20(PA4) ; port ADC_1
ADC_2: R63.2 U8.17(PA3) ; port ADC_2
BOOT: R59.2 U8.60(BOOT0) ; port BOOT
CS_1: U8.62(PB9) U15.1(~{CS}) ; port CS_1
CS_2: J10.5 U8.29(PB11) ; port CS_2
CS_3: J13.5 U8.33(PB12) ; port CS_3
DIRECT: J48.5 R39.2 R40.2 TP10.1(G9) U4.5(VIC) U8.61(PB8) ; port DIRECT
H_1: J6.2 R3.1 ; port H_1
H_2: J6.7 R2.1 ; port H_2
H_3: J6.3 R1.1 ; port H_3
HALL_A: C3.2 R3.2 R6.1 TP3.1(G9) U8.25(PB0) ; port HALL_A
HALL_B: C2.2 R2.2 R5.1 TP2.1(G9) U8.26(PB1) ; port HALL_B
HALL_C: C1.2 R1.2 R4.1 TP1.1(G9) U8.27(PB2) ; port HALL_C
I_OUT: C74.2 R69.2 TP62.1(G9) U14.3(VIN+) ; port I_OUT
LED_1: J53.3 R7.2 U8.11(PC3) ; port LED_1
LED_2: J53.4 R8.2 U8.24(PC4) ; port LED_2
LED_3: J53.5 R9.2 U8.37(PC6) ; port LED_3
LED_4: J49.5 R10.2 U8.38(PC7) ; port LED_4
LED_5: J49.4 R11.2 U8.39(PC8) ; port LED_5
LED_6: J49.3 R12.2 U8.40(PC9) ; port LED_6
LED_7: R46.2 U8.51(PC10) ; port LED_7
LED_8: R15.2 R47.2 TP4.1(G9) U8.52(PC11) U16.9(A8) ; port LED_8
MISO: J10.3 J13.3 U8.56(PB4) U15.2(DO_(IO1)) ; port MISO
MOSI: J10.2 J13.2 U8.57(PB5) U15.5(DI_(IO0)) ; port MOSI
OUT_N: C26.1 R51.1 TP26.1(G9) U7.6(VOUTN) ; port OUT_N1
OUT_P: C26.2 R49.1 TP22.1(G9) U7.7(VOUTP) ; port OUT_P1
PORT_1: R84.1 U8.8(PC0) ; port PORT_1
PORT_1_DIS: C64.2 Q1.3(C) R73.2 R76.2 U13.5(DISABLE) ; port PORT_1_DIS
PORT_2: R111.1 U8.9(PC1) ; port PORT_2
PORT_2_DIS: C97.2 Q2.3(C) R104.2 R108.2 U21.5(DISABLE) ; port PORT_2_DIS
PORT_3: R140.1 U8.10(PC2) ; port PORT_3
PORT_3_DIS: C126.2 Q3.3(C) R132.2 R147.2 U32.5(DISABLE) ; port PORT_3_DIS
PWM_1_1: R31.2 TP31.1(G9) U8.41(PA8) U16.2(A1) ; port PWM_1_1
PWM_1_1_STR: R45.2 TP47.1(G9) U13.1(INA) U16.18(Y1) ; port PWM_1_1_STR
PWM_1_2: R21.2 TP27.1(G9) U8.34(PB13) U16.3(A2) ; port PWM_1_2
PWM_1_2_STR: R44.2 TP46.1(G9) U13.2(INB) U16.17(Y2) ; port PWM_1_2_STR
PWM_2_1: R20.2 TP19.1(G9) U8.42(PA9) U16.4(A3) ; port PWM_2_1
PWM_2_1_STR: R43.2 TP43.1(G9) U16.16(Y3) U21.1(INA) ; port PWM_2_1_STR
PWM_2_2: R19.2 TP18.1(G9) U8.35(PB14) U16.5(A4) ; port PWM_2_2
PWM_2_2_STR: R42.2 TP42.1(G9) U16.15(Y4) U21.2(INB) ; port PWM_2_2_STR
PWM_3_1: R18.2 TP17.1(G9) U8.43(PA10) U16.6(A5) ; port PWM_3_1
PWM_3_1_STR: R37.2 TP41.1(G9) U16.14(Y5) U32.1(INA) ; port PWM_3_1_STR
PWM_3_2: R17.2 TP15.1(G9) U8.36(PB15) U16.7(A6) ; port PWM_3_2
PWM_3_2_STR: R35.2 TP40.1(G9) U16.13(Y6) U32.2(INB) ; port PWM_3_2_STR
PWM_SERVO: R16.2 TP12.1(G9) U8.22(PA6) U16.8(A7) ; port PWM_SERVO
PWR_ON: R33.2 R55.1 TP64.1(G9) U16.11(Y8) ; port PWR_ON
RESET: C48.2 R58.1 U8.7(~{RST}) ; port RESET
RX: J48.3 J52.5 R25.1 TP14.1(G9) U4.6(VOD) U8.59(PB7) ; port RX
SCK: J10.4 J13.4 U8.21(PA5) U15.6(CLK) ; port SCK
SENS_1: C87.2 D13.2(A) R120.2 R123.1 TP24.1(G9) U8.14(PA0-WKUP) ; port SENS_1
SENS_2: C89.2 D11.2(A) R121.2 R124.1 TP28.1(G9) U8.15(PA1) ; port SENS_2
SENS_3: C90.2 D15.2(A) R122.2 R125.1 TP29.1(G9) U8.16(PA2) ; port SENS_3
SERVO_OUT: J6.6 R34.2 TP65.1(G9) U16.12(Y7) ; port SERVO_OUT
SWCLC: J52.3 U8.49(PA14) ; port SWCLC
SWDIO: J52.2 U8.46(PA13) ; port SWDIO
SWO: J52.4 U8.55(PB3) ; port SWO
T_1: J6.8 P4.2 R22.1 ; port T_1
TIME_in_1: R22.2 R29.2 TP8.1(G9) U8.50(PA15) ; port TIME_in_1
TIME_in_2: R23.2 R30.2 TP7.1(G9) U8.28(PB10) ; port TIME_in_2
TX: J48.4 R28.1 TP11.1(G9) U4.4(VIB) U8.58(PB6) ; port TX
U_OUT: C76.2 R78.2 R79.2 TP66.1(G9) U7.2(VIN) ; port U_OUT
NetC8_1: C8.1 U8.5(PH0-OSC_IN) Y1.2
NetC10_1: C10.1 U8.6(PH1-OSC_OUT) Y1.1
NetC11_2: C11.2 C61.1(+) C62.2 C78.1 J7.1 J16.1 R61.1 R62.1 R86.1 R87.1 VD2.1(C) VD4.1(C) VT1.3(E) VT2.3(E) VT3.2(C) VT4.2(C)
NetC18_2: C18.2 U8.30(VCAP_1)
NetC27_1: C27.1 C29.1 R51.2 R53.1 TP25.1(G9) U5.4(VIN-)
NetC27_2: C27.2 R49.2 TP21.1(G9) U5.3(VIN+)
NetC29_2: C29.2 R50.2 R53.2 TP23.1(G9) U5.1(VOUT)
NetC41_2: C41.2 R57.2 R63.1 R65.2 TP34.1(G9)
NetC50_1: C50.1(+) C53.2 L7.1 U17.2(VOUT)
NetC65_2: C65.2 R72.2 U13.6(DT)
NetC67_1: C67.1(+) C69.2 L4.1 U19.2(VOUT)
NetC75_2: C75.2 DD1.6(FILTER)
NetC77_2: C77.2 R74.1 R75.1 R78.1 R80.2 TP67.1(G9)
NetC80_1: C80.1 DD1.1(IP+) DD1.2(IP+) J1.1
NetC81_1: C81.1 C83.2 C92.1(+) C94.2 J4.1 J26.1 R95.1 R96.1 R98.1 R99.1 VD11.1(C) VD13.1(C) VT5.3(E) VT6.3(E) VT7.2(C) VT8.2(C)
NetC84_1: C84.1 C85.2 C122.1(+) C123.2 J5.1 J36.1 R109.1 R110.1 R135.1 R136.1 VD21.1(C) VD23.1(C) VT9.3(E) VT10.3(E) VT11.2(C) VT12.2(C)
NetC98_2: C98.2 R107.2 U21.6(DT)
NetC127_2: C127.2 R146.2 U32.6(DT)
NetD1_1: D1.1(A) R7.1
NetD2_1: D2.1(A) R8.1
NetD3_1: D3.1(A) R9.1
NetD4_1: D4.1(A) R10.1
NetD5_1: D5.1(A) R11.1
NetD6_1: D6.1(A) R12.1
NetD7_1: D7.1(A) R46.1
NetD8_1: D8.1(A) R39.1
NetD9_1: D9.1(A) R47.1
NetD10_1: D10.1(K) L1.1 U18.2(Output)
NetD12_1: D12.1(C) R60.1 U13.15(OUTA)
NetD12_2: D12.2(A) J14.1 R60.2 R61.2 R83.1 R85.1 VD2.2(A)
NetD14_1: D14.1(C) R77.1 U13.10(OUTB)
NetD14_2: D14.2(A) J19.1 R77.2 R81.2 R89.1 R90.1 VD6.2(A)
NetD17_1: D17.1(C) R92.1 U21.15(OUTA)
NetD17_2: D17.2(A) J24.1 R92.2 R94.1 R95.2 R97.1 VD11.2(A)
NetD19_1: D19.1(C) R115.1 U21.10(OUTB)
NetD19_2: D19.2(A) J29.1 R100.1 R101.1 R115.2 R118.2 VD15.2(A)
NetD21_1: D21.1(C) R131.1 U32.15(OUTA)
NetD21_2: D21.2(A) J34.1 R105.1 R106.1 R131.2 R135.2 VD21.2(A)
NetD24_1: D24.1(C) R149.1 U32.10(OUTB)
NetD24_2: D24.2(A) J38.1 R112.1 R114.1 R149.2 R152.2 VD25.2(A)
NetDD1_7: DD1.7(VIOUT) R69.1
NetP5_2: P5.2 R23.1
NetP6_1: P6.1 P7.1 R41.2 U3.7(B) ZD2.1(A)
NetP6_3: P6.3 P7.3 R24.1 U3.6(A) ZD1.1(A)
NetP13_2: P13.2 R120.1
NetP14_2: P14.2 R121.1
NetP15_2: P15.2 R122.1
NetQ1_1: Q1.1(B) R84.2 R88.1
NetQ2_1: Q2.1(B) R111.2 R113.1
NetQ3_1: Q3.1(B) R140.2 R143.1
NetQ4_1: Q4.1(G) R48.2 T1.3(C)
NetR13_2: R13.2 U15.7(~{HOLD}/~{RESET}_(IO3))
NetR14_2: R14.2 U15.3(~{WP}_(IO2))
NetR26_1: R26.1 R32.1 TP9.1(G9) U3.4(DI)
NetR27_1: R27.1 R36.1 TP16.1(G9) U3.1(RO)
NetR32_2: R32.2 U4.13(VOB)
NetR36_2: R36.2 U4.11(VID)
NetR38_2: R38.2 TP13.1(G9) U3.2(~{RE}) U3.3(DE) U4.12(VOC)
NetR55_2: R55.2 R56.1 T1.1(B)
NetR57_1: R57.1 R64.2 U14.1(VOUT)
NetR64_1: R64.1 R66.2 U14.4(VIN-)
NetR67_1: R67.1 R68.2 TP61.1(G9) U18.4(Feedback)
NetR70_1: R70.1 R71.2
NetR71_1: R71.1 R74.2
NetR83_2: R83.2 R87.2 VT1.1(G)
NetR85_2: R85.2 R86.2 VT2.1(G)
NetR89_2: R89.2 R93.2 VT3.1(G)
NetR90_2: R90.2 R91.2 VT4.1(G)
NetR94_2: R94.2 R99.2 VT5.1(G)
NetR97_2: R97.2 R98.2 VT6.1(G)
NetR100_2: R100.2 R103.2 VT7.1(G)
NetR101_2: R101.2 R102.2 VT8.1(G)
NetR105_2: R105.2 R109.2 VT9.1(G)
NetR106_2: R106.2 R110.2 VT10.1(G)
NetR112_2: R112.2 R116.2 VT11.1(G)
NetR114_2: R114.2 R117.2 VT12.1(G)

Not connected (* = marked no-connect by the designer): U4 3(VIA) 14(VOA); U8 2(PC13) 3(PC14-OSC32_IN) 4(PC15-OSC32_OUT) 23(PA7) 44(PA11) 45(PA12) 53(PC12) 54(PD2); U13 7(NC) 12(NC) 13(NC); U21 7(NC) 12(NC) 13(NC); U32 7(NC) 12(NC) 13(NC)

## Layout directives
differential pair: (no net found under the mark), OUT_N
mark named +8VDC: +V_Servo

## Notes on the sheet
- (in symbol MCP6001T) +; -

## Library data of the parts
C1-C4 C6 C18 C25-C29 C31 C35 C36 C38 C40-C42 C45 C46 C48 C52-C54 C56 C59 C60 C66 C69 C72 C73 C75-C77 C87 C89 C90 C127 = CAP-NON-POLAR
C8 C10 = CMP-2007-03453-2: Chip Multilayer Ceramic Capacitors for General Purpose, 0805, 16pF, X5R, 15%, 10%, 16V; Capacitance: 10uF; Radiation Hardening: No; Thickness: 0.053inch; Voltage Rating (DC): 16V; Lead Free: Lead Free; Package Quantity: 1; Width: 1.25mm; Case Code (Imperial): 0805; Depth: 1.25mm; Packaging: Tape and Reel; Dielectric: X5R; Max Operating Temperature: 85°C; Tolerance: 10%; Voltage Rating: 16V; Voltage: 16V; Height: 1.25mm; Case Code (Metric): 2012; Material: Ceramic; Mount: Surface Mount; Case/Package: 0805; REACH SVHC: No SVHC; Length: 2mm; Min Operating Temperature: -55°C; Termination: SMD/SMT
C9 = CMP-1036-04552-2: CAP CER 0.22UF 50V X7R 0805; Manufacturer: KEMET; Value: 0.22 μF; Temperature Coefficient: 30ppm/°C; Material: Ceramic; Tolerance: 0.1; ComponentLink2URL: https://content.kemet.com/datasheets/KEM_C1003_C0G_SMD.pdf; Temperature Characteristic: X7R; Device Class L3: Ceramic Capacitors; Lead Free: Yes; Temperature: -55°C to +125°C; RoHS: TRUE; Capacitance: 0.22 μF; Automotive: No; Octopart: https://octopart.com/c0805c224k5ractu-kemet-144670; Manufacturer Part Number: C0805C224K5RACTU; Temperature Range Low: -55°C; Height: 0.88mm; Device Class L1: Passive Components; Digikey Description: CAP CER 0.22UF 50V X7R 0805; ComponentLink2Description: Datasheet; Mouser Description: CAP CER 0.22UF 50V X7R 0805; Category: Cap; Ipc Land Pattern Name: CAPC200125X78; Temperature Range High: +125°C; Package: C0805C-DN; Device Class L2: Capacitors; Voltage Rating: 50 V
C30 C33 C37 C43 C44 C47 C49-C51 C55 C58 C63 C67 C68 C71 C88 C104 C117 C139 = CAP-POLAR
C32 = CAP_POL_SMD
C74 = CAP-NON-POLAR: 270pF
C81 = CAP-V
D1-D9 = LED: WURTH ELEKTRONIK - 151031YS06000 - LED, Yellow, Through Hole, T-1 (3mm), 30 mA, 2 V, 590 nm; Geometry.Height: 5.5mm; Manufacturer_Name: Wurth Elektronik; Manufacturer_Part_Number: 151031YS06000; Mouser Part Number: 710-151031YS06000; Mouser Price/Stock: https://www.mouser.co.uk/ProductDetail/Wurth-Elektronik/151031YS06000?qs=LlUlMxKIyB3xSYYW%252BcuBiQ%3D%3D; Arrow Part Number: *; Arrow Price/Stock: *; Mouser Testing Part Number: *; Mouser Testing Price/Stock: *; Datasheet Link: https://katalog.we-online.de/led/datasheet/151031YS06000.pdf
D10 = SS36_Schottky
J1-J5 J7 = Connector_MEIGAN_MG136HT
J6 = DB9
J14 J16 J19 J21 J24 J26 J29 J31 J34 J36 J38 J40 = Klema_15_A
J48 J49 J52 J53 = SWR25X-NRTC-S06-ST-BA
L1 L2 = 744776122: WE-PD2 SMT Power Inductor, size 1054, 22µH, 2.04A, 0.1Ω; Manufacturer: Wurth Elektronik; Case/Size Code: 1054; DC Resistance: 0.051Ω; Saturation Current: 2.07A; Self Resonant Frequency: 16MHz; Manufacturer Part Number: 744776122; Category: Unshielded Power Inductors; Match Code: WE-PD2; ComponentLink1Description: Website Link; ComponentLink1URL: https://www.we-online.com/redexpert/article/744776122?ad; ComponentLink2Description: Datasheet Link; ComponentLink2URL: https://www.we-online.com/redexpert/spec/744776122?ad; Mount: Surface Mount; Operating Temperature Max: 125°C; Operating Temperature Min: -40°C; Packaging: Tape and Reel; Length: 10mm; Width: 9mm; Height: 5.4mm; DC Resistance Max: 0.1Ω; Inductance: 22µH; Rated Current: 2.04A
L3 = CMP-0227-00501-2: NexarPartId: 24533346; Inductance: 270µH; Current Rating: 620mA; Self Resonant Frequency: 4MHz; DC Resistance (DCR): 500mΩ; Ambient Temperature Range Low: -40°C; Min Operating Temperature: -40°C; RoHS: Compliant; Ambient Temperature Range High: 85°C; Packaging: Digi-Reel®; Height: 5.4mm; Length: 9mm; Max Operating Temperature: 125°C; Width: 10mm
L4 L6 L7 = 74477530: WE-PD2 SMT Power Inductor, size 7850, 1000µH, 0.3A, 3.3Ω; Manufacturer: Wurth Elektronik; Case/Size Code: 7850; DC Resistance: 2.78Ω; Self Resonant Frequency: 2.4MHz; Manufacturer Part Number: 74477530; Category: Unshielded Power Inductors; Match Code: WE-PD2; ComponentLink1Description: Website Link; ComponentLink1URL: https://www.we-online.com/redexpert/article/74477530?ad; ComponentLink2Description: Datasheet Link; ComponentLink2URL: https://www.we-online.com/redexpert/spec/74477530?ad; Mount: Surface Mount; Operating Temperature Max: 125°C; Operating Temperature Min: -40°C; Packaging: Tape and Reel; Length: 7.8mm; Width: 7mm; Height: 4.95mm; DC Resistance Max: 3.3Ω; Inductance: 1000µH; Rated Current: 0.3A; Saturation Current: 0.3A
P4 P5 P13-P15 = 61900311121: WR-WTB THT Male Vertical Locking Header, pitch 2.54mm, 3p; Pin Number: 3; Contact Resistance: 20mOhm; Rated Current: 3A; Withstanding Voltage: 1000VAC; Working Voltage: 250VAC; ComponentLink1Description: Manufacturer; ComponentLink1URL: http://www.we-online.de; ComponentLink2Description: Datasheet; ComponentLink2URL: https://www.we-online.com/catalog/datasheet/61900311121.pdf; Pitch: 2.54mm; Published Date: January 2020; Publisher: Wurth Elektronik; Mounting Technology: THT; Packaging: Bag; Operating Temperature: -40 to +105degC; Part Number: 61900311121; Gender: Male; Type: Vertical
P6 P7 = 691305540003: WR-TBL Series 3055 PCB Header Horizontal Entry with Plastic Latches, THT, pitch 5.08mm, 3p; Manufacturer: Wurth Elektronik; Modularity: No; Rated Current: 16A; Working Voltage: 300V; ComponentLink1Description: Website Link; ComponentLink1URL: https://www.we-online.com/redexpert/article/691305540003?ad; ComponentLink2Description: Datasheet Link; ComponentLink2URL: https://www.we-online.com/redexpert/spec/691305540003?ad; Manufacturer Part Number: 691305540003; Category: Terminal Blocks; Match Code: WR-TBL; Mount: Through Hole; Operating Temperature Max: 105°C; Operating Temperature Min: -40°C; Packaging: Box; Application: Pluggable; Number of Pins: 3; Number of Rows: 1; Orientation: Horizontal; Pitch: 5.08mm
P8-P10 = 691305540002: WR-TBL Series 3055 PCB Header Horizontal Entry with Plastic Latches, THT, pitch 5.08mm, 2p; Manufacturer: Wurth Elektronik; Modularity: No; Rated Current: 16A; Working Voltage: 300V; ComponentLink1Description: Website Link; ComponentLink1URL: https://www.we-online.com/redexpert/article/691305540002?ad; ComponentLink2Description: Datasheet Link; ComponentLink2URL: https://www.we-online.com/redexpert/spec/691305540002?ad; Manufacturer Part Number: 691305540002; Category: Terminal Blocks; Match Code: WR-TBL; Mount: Through Hole; Operating Temperature Max: 105°C; Operating Temperature Min: -40°C; Packaging: Box; Application: Pluggable; Number of Pins: 2; Number of Rows: 1; Orientation: Horizontal; Pitch: 5.08mm
Q1-Q3 = BC847C_Infineon: NPN Silicon AF Transistor, 45 V VCEO, 100 mA IC, SOT23, Reel, Green; Ptot (max): 330Â mW; VEBO (max): 6Â V; IBM (max): 200Â mA; VCBO (max): 50Â V; Green: TRUE; fT (typ): 250Â MHz; VCEO (max): 45Â V; IC (max): 100Â mA; ICBO (max): 15Â nA; Polarity: NPN; PartNumber: BC847C; PackageVersion: Apr-08; ComponentLink1Description: Manufacturer URL; ComponentLink2Description: Datasheet; ComponentLink3URL: http://www.infineon.com/dgdl/SOT23-Package_Overview.pdf?folderId=db3a30431936bc4b0119532290053c66&fileId=db3a30431936bc4b0119533468123c85; ComponentLink3Description: Package Specification; ComponentLink1URL: http://www.infineon.com/; Packing: Reel; ComponentLink2URL: http://www.infineon.com/dgdl/bc847series_bc848series_bc849series_bc850series.pdf?folderId=db3a304314dca389011541d30fa21656&fileId=db3a304314dca389011541d4630a1657; Manufacturer: Infineon; ICM (max): 200Â mA; Mounting Technology: Surface Mount; PackageReference: SOT23; PackageDescription: 3-Pin Small Outline Transistor Package, 1.3 x 2.9 mm Body, 0.95 mm Pitch
Q4 = BSS84: P-mosfet
R1-R47 R49-R62 R65-R67 R69 R72 R73 R75-R79 R81-R85 R88-R90 R92 R94-R97 R100 R101 R104-R108 R111-R115 R118-R125 R131 R132 R135 R136 R140 R143 R146 R147 R149 R152 R153 = RES-CONST
R48 = RES-CONST: 100K
R63 R64 R86 R87 R91 R93 R98 R99 R102 R103 R109 R110 R116 R117 = RES-CONST: 10K
R68 = RES-CONST: 1K
R70 R71 = RES-CONST: 100K 1%
R74 = RES-CONST: 100K  1%
TP1-TP31 TP34 TP36 TP40-TP44 TP46-TP50 TP52-TP54 TP56-TP59 TP61 TP62 TP64-TP67 TP69 = TP_PCB?: Test_Point
U1 U6 U10 = DC-DC/12-18VDC
U4 = CMP-0534-00565-1: Quad Channel Digital Isolator, 2.5 KV rms Insulation Rating, 10 Mbps Data Rate, 50 ns Delay, Industrial, 16-pin SOIC (RW-16), Tube; Manufacturer: Analog Devices; Max Data Rate: 10Mbps; ComponentLink2URL: http://www.analog.com/static/imported-files/data_sheets/ADuM1400_1401_1402.pdf; ComponentLink5Description: URL Link2; ComponentLink3URL: http://www.analog.com/static/imported-files/packages/PKG_PDF/SOIC_WIDE%20%28RW%29/RW_16.pdf; DatasheetVersion: Rev. H; ComponentLink2Description: Datasheet; ComponentLink3Description: Package Specification; PartNumber: ADUM1401BRWZ; ComponentLink5URL: Reference Circuit:http://www.analog.com/en/interface-isolation/digital-isolators/adum1401/products/product.html#product-recommendations; Max Operating Temp (degreesC): 125; PackageReference: RW-16; PackageVersion: 032707-B, 03/2007; ComponentLink1Description: Manufacturer URL; Code_JEDEC: MS-013-AA; PackageDescription: 16-Pin Standard Small Outline Package, Body 10.3 x 7.5 mm, Pitch 1.27 mm; Mounting Technology: Surface Mount; ComponentLink1URL: http://www.analog.com/en/index.html; ComponentLink4Description: URL Link1; ComponentLink4URL: Product URL:http://www.analog.com/en/interface-isolation/digital-isolators/adum1401/products/product.html
U5 = MCP6001T: IC OPAMP GP 1 CIRCUIT SOT23-5; Number of Amplifiers: 1; Voltage: 6V; Power Supply Rejection Ratio (PSRR): 86dB; Common Mode Rejection Ratio: 60dB; Unity Gain Bandwidth Product: 1MHz; Slew Rate: 0.6V/µs; Output Current per Channel: 23mA; Nominal Supply Current: 100uA; Input Offset Voltage (Vos): 4.5mV; Input Bias Current: 1pA; Operating Supply Voltage: 5.5V; Min Supply Voltage: 1.8V; Voltage Gain: 112dB; Length: 3.1mm; REACH SVHC: No SVHC; Number of Pins: 5; Package Quantity: 1; Radiation Hardening: No; Mount: Surface Mount; Number of Circuits: 1; Number of Elements: 1; Output Current: 23mA; Packaging: Tape and Reel; Height: 1.3mm; Lead Free: Lead Free; Min Operating Temperature: -40°C; Bandwidth: 1MHz; Contact Plating: Tin; Max Supply Voltage: 6V; Max Operating Temperature: 85°C; Width: 1.8mm; Case/Package: SOT-23; Operating Supply Current: 100uA; Number of Channels: 1; Gain Bandwidth Product: 1MHz
U9 U11 U17 U19 = AMS1117
U14 = MCP6001T
U18 = LM2576D2T-005G
VD2 VD6 VD11 VD15 VD21 VD25 = Suppressor
VD4 VD8 VD13 VD17 VD23 VD27 = ZENER
VT1-VT12 = IGBT 60N120T: IGBT 60N120T TO-264-3
Y1 = CMP-1749-00004-1: Resistance Weld Thru-Hole Crystal, 12 MHz, +/-30 ppm, -20 to 70 degC, 2-Pin THD, RoHS, Bulk; Elements: 1; Rds On Max: 115 mohm; Typical Rise Time: 90 ns; Max Power Dissipation: 2.5 W; Case\Package: TO-251-3; Input Capacitance: 350 pF; REACH SVHC: No SVHC; Length: 6.6 mm; ComponentLink1URL: http://www.foxonline.com/; PackageDescription: 2-Pin Through Hole Device, Body 11.35 x 4.65 mm, Pitch 4.88 mm; Radiation Hardening: No; Package Quantity: 70; Packaging: Rail/Tube; ComponentLink1Description: Manufacturer URL; Min Operating Temperature: -55 degC; Max Operating Temperature: 150 degC; RoHSCompliant: true; PackageReference: FOXSLF-2; DatasheetVersion: Mar-15; Pins: 3; Height: 6.1 mm; Mount: Through Hole; ComponentLink2URL: http://www.foxonline.com/pdfs/hc49slf.pdf; ComponentLink2Description: Datasheet; Width: 2.3 mm